# EAGLE design GadgetBox-Papilio-Flex (EAGLE 6.6.0)

## Sheet 1 of 3: Connectors
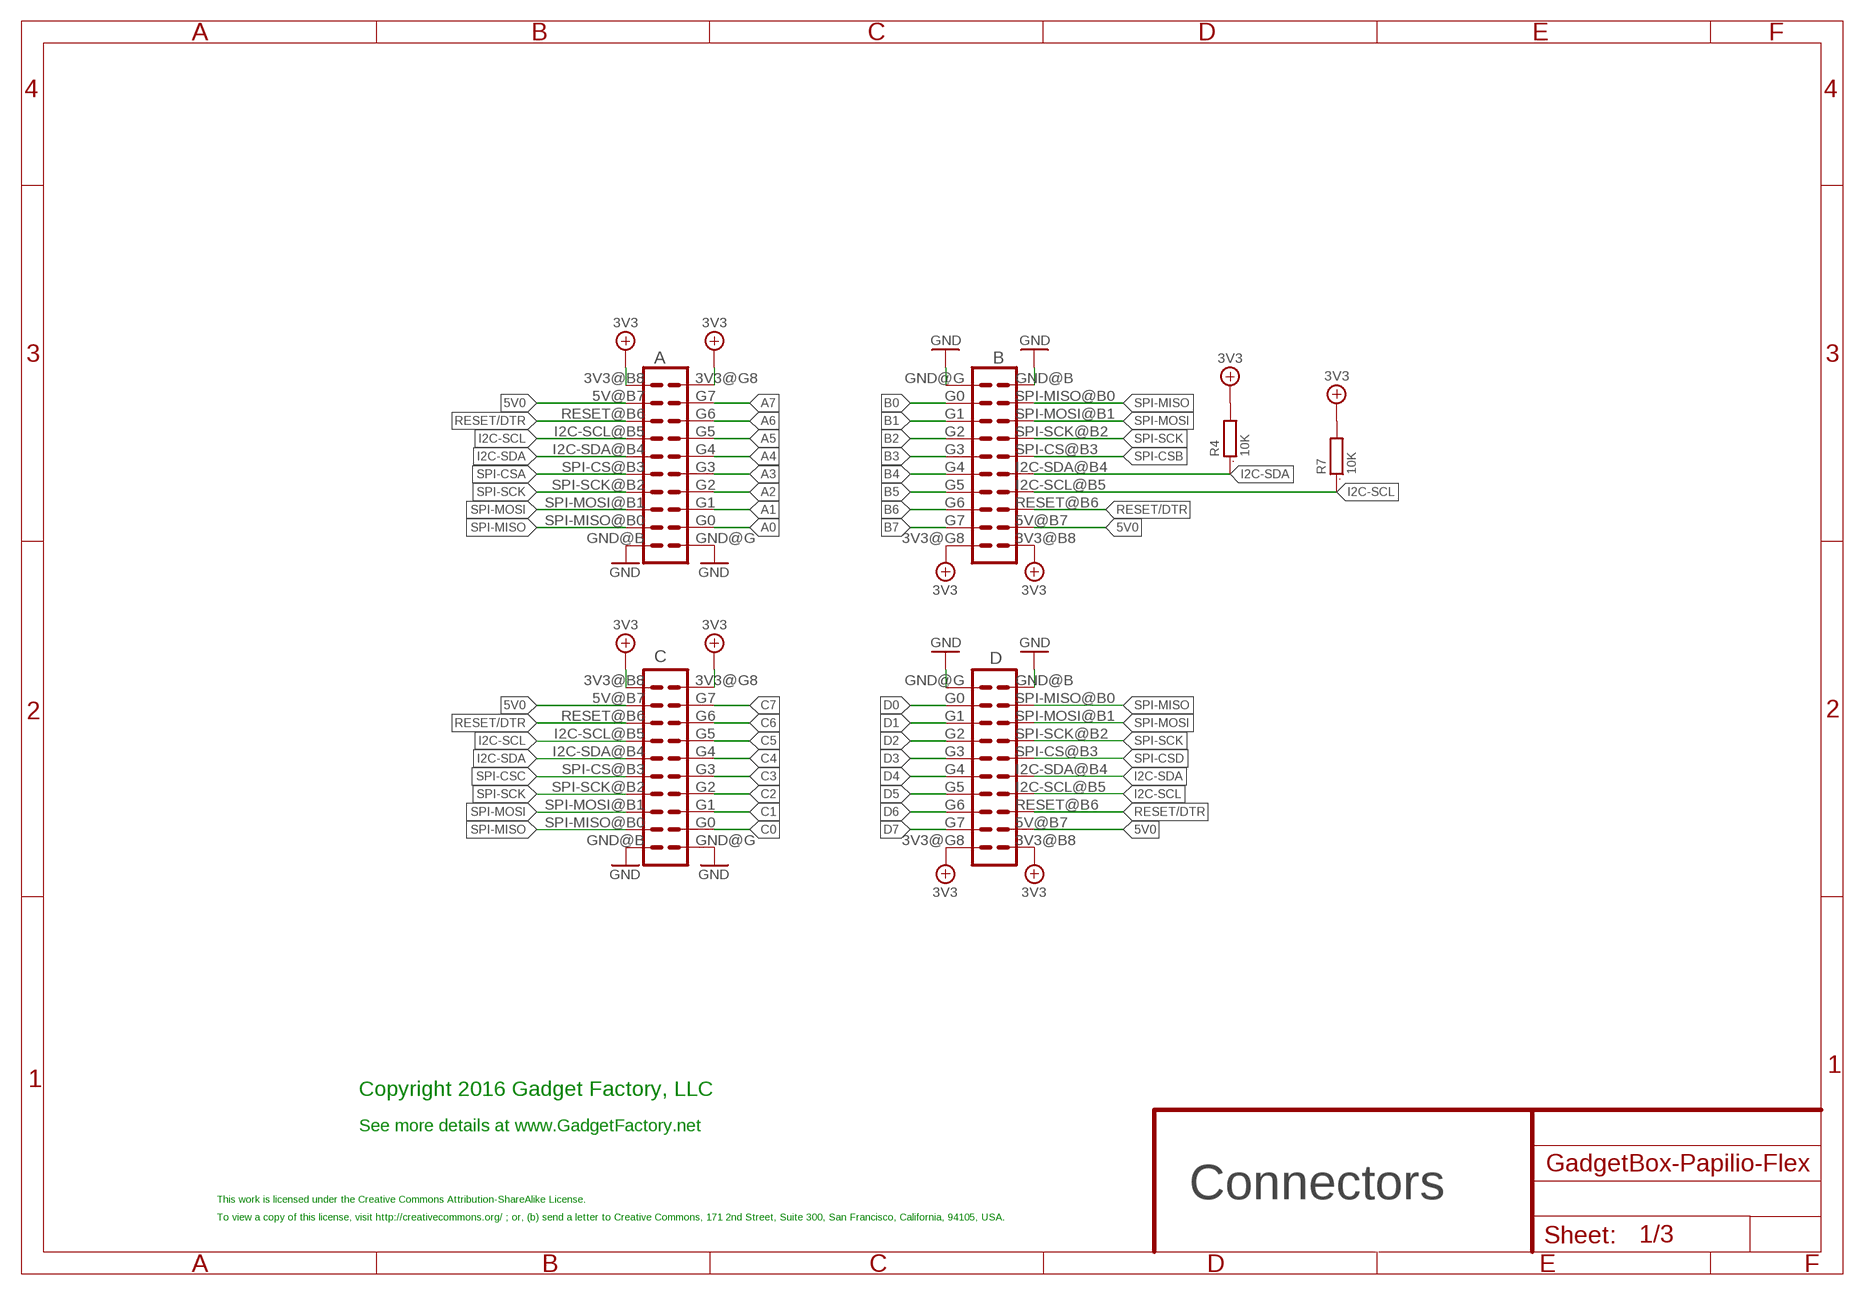
[diagram p0: schematic, sheet 1]

### Parts
A  ECOGECOG_SLOT_ALT1  [ECOG_ALT1]
B  ECOGECOG_SLOT_ALT1  [ECOG_ALT1]
C  ECOGECOG_SLOT_ALT1  [ECOG_ALT1]
D  ECOGECOG_SLOT_ALT1  [ECOG_ALT1]
R4  10K  R0603  [0603]
R7  10K  R0603  [0603]

### Nets
3V3: A.3V3@B8(3V3) A.3V3@G8(3V3) B.3V3@B8(3V3) B.3V3@G8(3V3) C.3V3@B8(3V3) C.3V3@G8(3V3) D.3V3@B8(3V3) D.3V3@G8(3V3) R4.2 R7.2 ; also sheet 2,3
5V0: A.5V@B7(5V) B.5V@B7(5V) C.5V@B7(5V) D.5V@B7(5V) ; also sheet 2,3
A0: A.G0 ; also sheet 3
A1: A.G1 ; also sheet 3
A2: A.G2 ; also sheet 3
A3: A.G3 ; also sheet 3
A4: A.G4 ; also sheet 3
A5: A.G5 ; also sheet 3
A6: A.G6 ; also sheet 3
A7: A.G7 ; also sheet 3
B0: B.G0 ; also sheet 3
B1: B.G1 ; also sheet 3
B2: B.G2 ; also sheet 3
B3: B.G3 ; also sheet 3
B4: B.G4 ; also sheet 3
B5: B.G5 ; also sheet 3
B6: B.G6 ; also sheet 3
B7: B.G7 ; also sheet 3
C0: C.G0 ; also sheet 3
C1: C.G1 ; also sheet 3
C2: C.G2 ; also sheet 3
C3: C.G3 ; also sheet 3
C4: C.G4 ; also sheet 3
C5: C.G5 ; also sheet 3
C6: C.G6 ; also sheet 3
C7: C.G7 ; also sheet 3
D0: D.G0 ; also sheet 3
D1: D.G1 ; also sheet 3
D2: D.G2 ; also sheet 3
D3: D.G3 ; also sheet 3
D4: D.G4 ; also sheet 3
D5: D.G5 ; also sheet 3
D6: D.G6 ; also sheet 3
D7: D.G7 ; also sheet 3
GND: A.GND@B(GND) A.GND@G(GND) B.GND@B(GND) B.GND@G(GND) C.GND@B(GND) C.GND@G(GND) D.GND@B(GND) D.GND@G(GND) ; also sheet 2,3
I2C-SCL: A.I2C-SCL@B5(I2C-SCL) B.I2C-SCL@B5(I2C-SCL) C.I2C-SCL@B5(I2C-SCL) D.I2C-SCL@B5(I2C-SCL) R7.1 ; also sheet 3
I2C-SDA: A.I2C-SDA@B4(I2C-SDA) B.I2C-SDA@B4(I2C-SDA) C.I2C-SDA@B4(I2C-SDA) D.I2C-SDA@B4(I2C-SDA) R4.1 ; also sheet 3
RESET/DTR: A.RESET@B6(RESET) B.RESET@B6(RESET) C.RESET@B6(RESET) D.RESET@B6(RESET) ; also sheet 2,3
SPI-CSA: A.SPI-CS@B3(SPI-CS) ; also sheet 3
SPI-CSB: B.SPI-CS@B3(SPI-CS) ; also sheet 3
SPI-CSC: C.SPI-CS@B3(SPI-CS) ; also sheet 3
SPI-CSD: D.SPI-CS@B3(SPI-CS) ; also sheet 3
SPI-MISO: A.SPI-MISO@B0(SPI-MISO) B.SPI-MISO@B0(SPI-MISO) C.SPI-MISO@B0(SPI-MISO) D.SPI-MISO@B0(SPI-MISO) ; also sheet 3
SPI-MOSI: A.SPI-MOSI@B1(SPI-MOSI) B.SPI-MOSI@B1(SPI-MOSI) C.SPI-MOSI@B1(SPI-MOSI) D.SPI-MOSI@B1(SPI-MOSI) ; also sheet 3
SPI-SCK: A.SPI-SCK@B2(SPI-SCK) B.SPI-SCK@B2(SPI-SCK) C.SPI-SCK@B2(SPI-SCK) D.SPI-SCK@B2(SPI-SCK) ; also sheet 3

### Notes on the sheet
- Copyright 2016 Gadget Factory, LLC
- See more details at www.GadgetFactory.net
- Connectors
- This work is licensed under the Creative Commons Attribution-ShareAlike License.
- To view a copy of this license, visit http://creativecommons.org/ ; or, (b) send a letter to Creative Commons, 171 2nd Street, Suite 300, San Francisco, California, 94105, USA.

## Sheet 2 of 3: Power
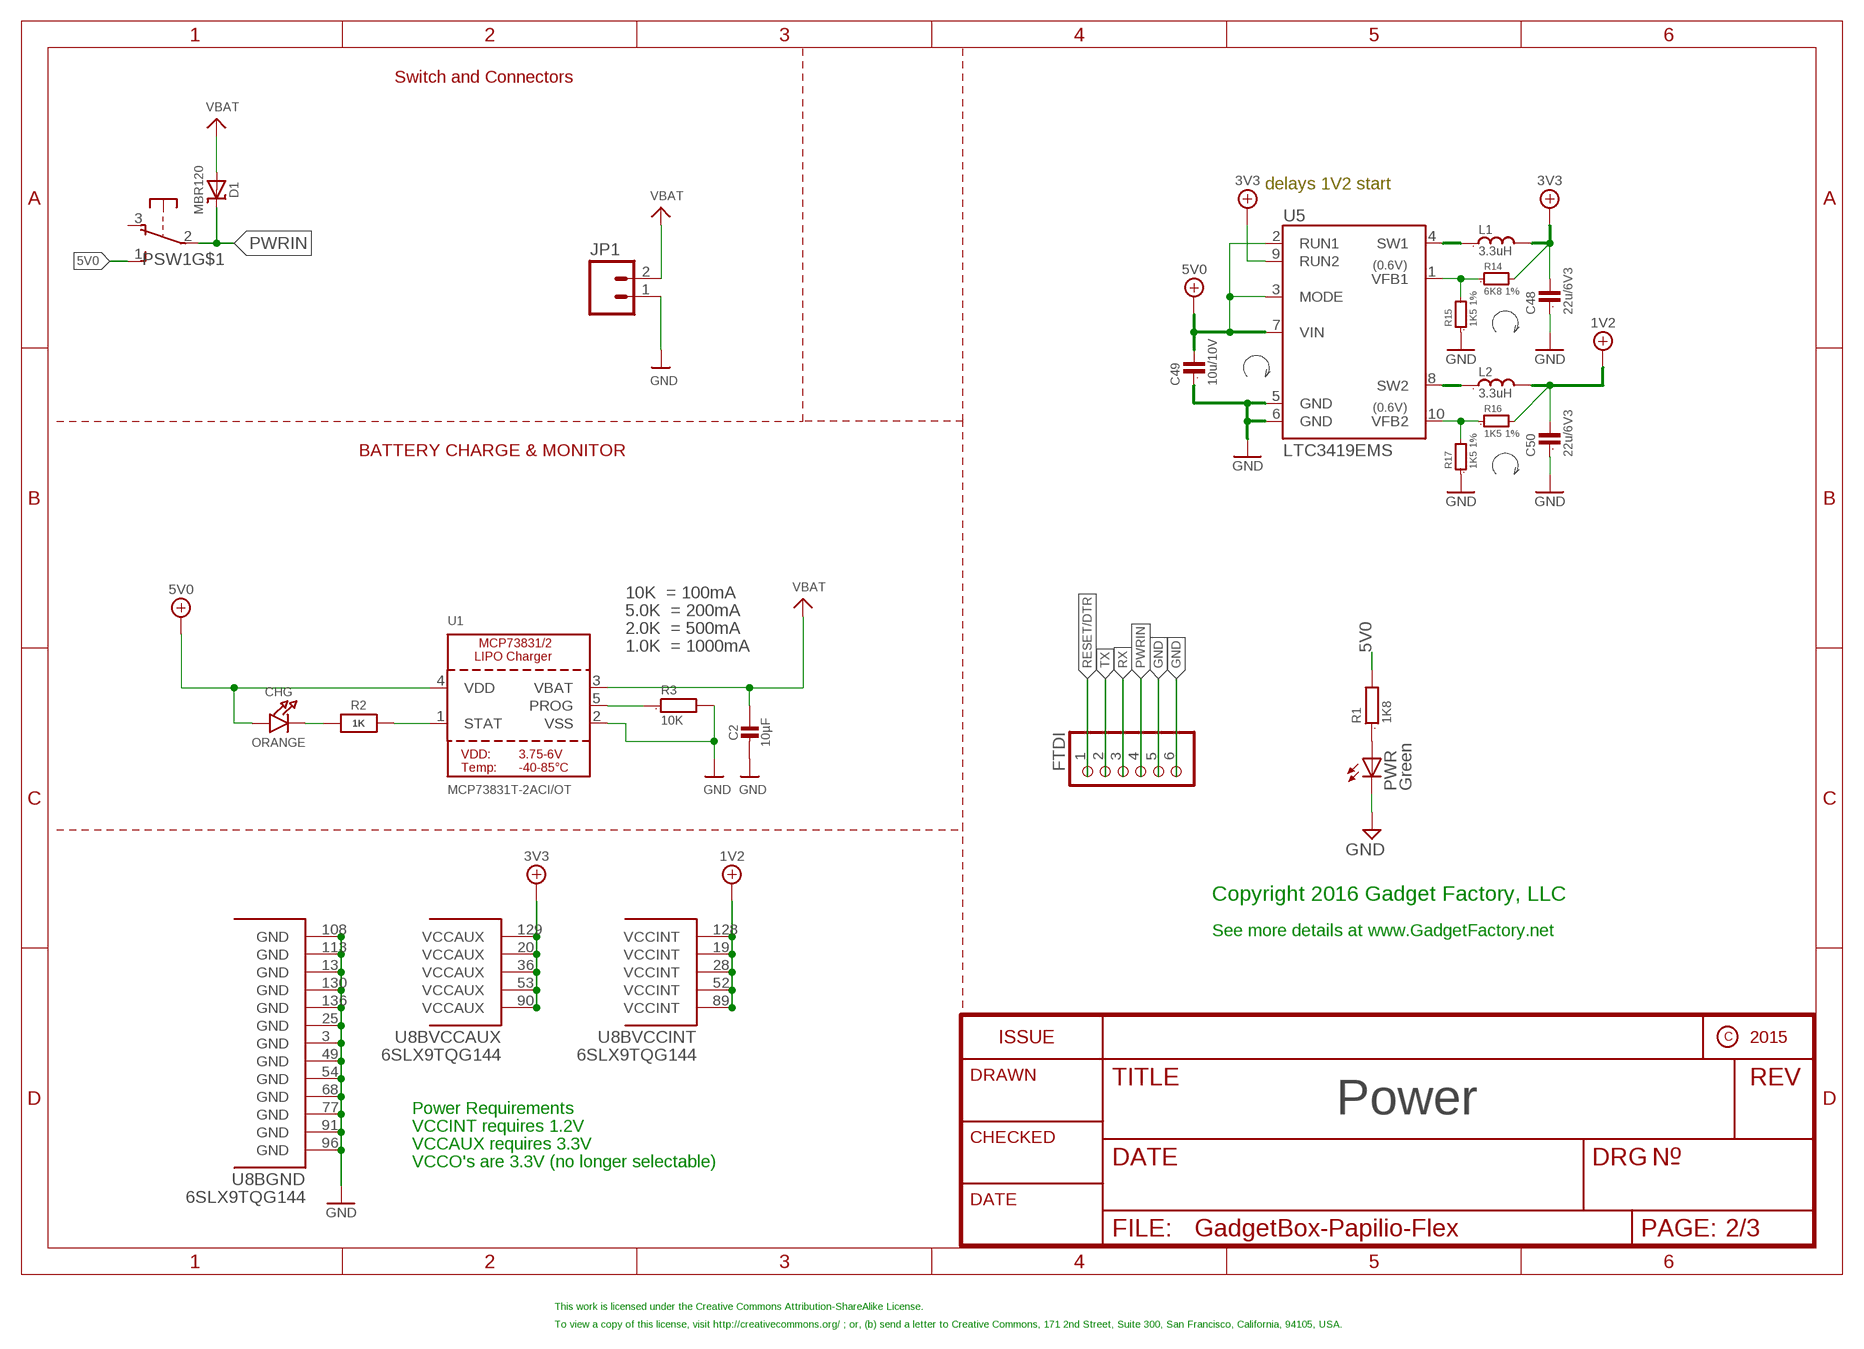
[diagram p1: schematic, sheet 2]

### Parts
C2  10µF  CAP_CERAMIC0805-NOOUTLINE  [0805-NO]
C48  22u/6V3  C0805  [0805]
C49  10u/10V  C0805  [0805]
C50  22u/6V3  C0805  [0805]
CHG  ORANGE  LED0805_NOOUTLINE  [CHIPLED_0805_NOOUTLINE]
D1  MBR120  DIODE-SCHOTTKYSOD-123  [SOD-123]
FTDI  PINHD-1X6  [1X06]
JP1  M02JST-PTH-2  [JST-2-PTH]
L1  3.3uH  L_VLS3015  [VLS3015]
L2  3.3uH  L_VLS3015  [VLS3015]
PSW1  OS102011MA1Q  [OS102011MA1Q]
PWR  Green  LEDCHIP-LED0805  [CHIP-LED0805]
R1  1K8  R0805  [0805]
R2  1K  RESISTOR_0603_NOOUT  [0603-NO]
R3  10K  R0603  [0603]
R14  6K8 1%  R-SMALL0603  [0603]
R15  1K5 1%  R-SMALL0603  [0603]
R16  1K5 1%  R-SMALL0603  [0603]
R17  1K5 1%  R-SMALL0603  [0603]
U1  MCP73831T-2ACI/OT  MCP73831/2  [SOT23-5]
U5  LTC3419EMS  [MSOP10]
U8  6SLX9TQG144  [TQ144]

### Nets
1V2: C50.2 L2.2 R16.2 U8.19(BVCCINT:VCCINT) U8.28(BVCCINT:VCCINT) U8.52(BVCCINT:VCCINT) U8.89(BVCCINT:VCCINT) U8.128(BVCCINT:VCCINT) ; also sheet 3
3V3: C48.2 L1.2 R14.2 U5.9(RUN2) U8.20(BVCCAUX:VCCAUX) U8.36(BVCCAUX:VCCAUX) U8.53(BVCCAUX:VCCAUX) U8.90(BVCCAUX:VCCAUX) U8.129(BVCCAUX:VCCAUX) ; also sheet 1,3
5V0: C49.2 CHG.A PSW1.1(S) R1.2 U1.4(VDD) U5.2(RUN1) U5.3(MODE) U5.7(VIN) ; also sheet 1,3
FB_1V2: R16.1 R17.2 U5.10(VFB2)
FB_3V3: R14.1 R15.2 U5.1(VFB1)
GND: C2.2 C48.1 C49.1 C50.1 FTDI.5 FTDI.6 JP1.1 PWR.C R3.2 R15.1 R17.1 U1.2(VSS) U5.5(GND) U5.6(GND) U8.3(BGND:GND) U8.13(BGND:GND) U8.25(BGND:GND) U8.49(BGND:GND) U8.54(BGND:GND) U8.68(BGND:GND) U8.77(BGND:GND) U8.91(BGND:GND) U8.96(BGND:GND) U8.108(BGND:GND) U8.113(BGND:GND) U8.130(BGND:GND) U8.136(BGND:GND) ; also sheet 1,3
N$1: PWR.A R1.1
N$2: CHG.C R2.1
N$3: R2.2 U1.1(STAT)
N$4: R3.1 U1.5(PROG)
PWRIN: D1.C FTDI.4 PSW1.2(P) ; also sheet 3
RESET/DTR: FTDI.1 ; also sheet 1,3
RX: FTDI.3 ; also sheet 3
SW_1V2: L2.1 U5.8(SW2)
SW_3V3: L1.1 U5.4(SW1)
TX: FTDI.2 ; also sheet 3
VBAT: C2.1 D1.A JP1.2 U1.3(VBAT)
Unconnected: PSW1.3(O) PSW1.MT1(MT) PSW1.MT2(MT)

### Notes on the sheet
- Switch and Connectors
- delays 1V2 start
- BATTERY CHARGE & MONITOR
- 10K  = 100mA
- 5.0K  = 200mA
- 2.0K  = 500mA
- 1.0K  = 1000mA
- Copyright 2016 Gadget Factory, LLC
- See more details at www.GadgetFactory.net
- Power Requirements | Power
- VCCINT requires 1.2V
- VCCAUX requires 3.3V
- VCCO's are 3.3V (no longer selectable)
- This work is licensed under the Creative Commons Attribution-ShareAlike License.
- To view a copy of this license, visit http://creativecommons.org/ ; or, (b) send a letter to Creative Commons, 171 2nd Street, Suite 300, San Francisco, California, 94105, USA.

## Sheet 3 of 3: FPGA
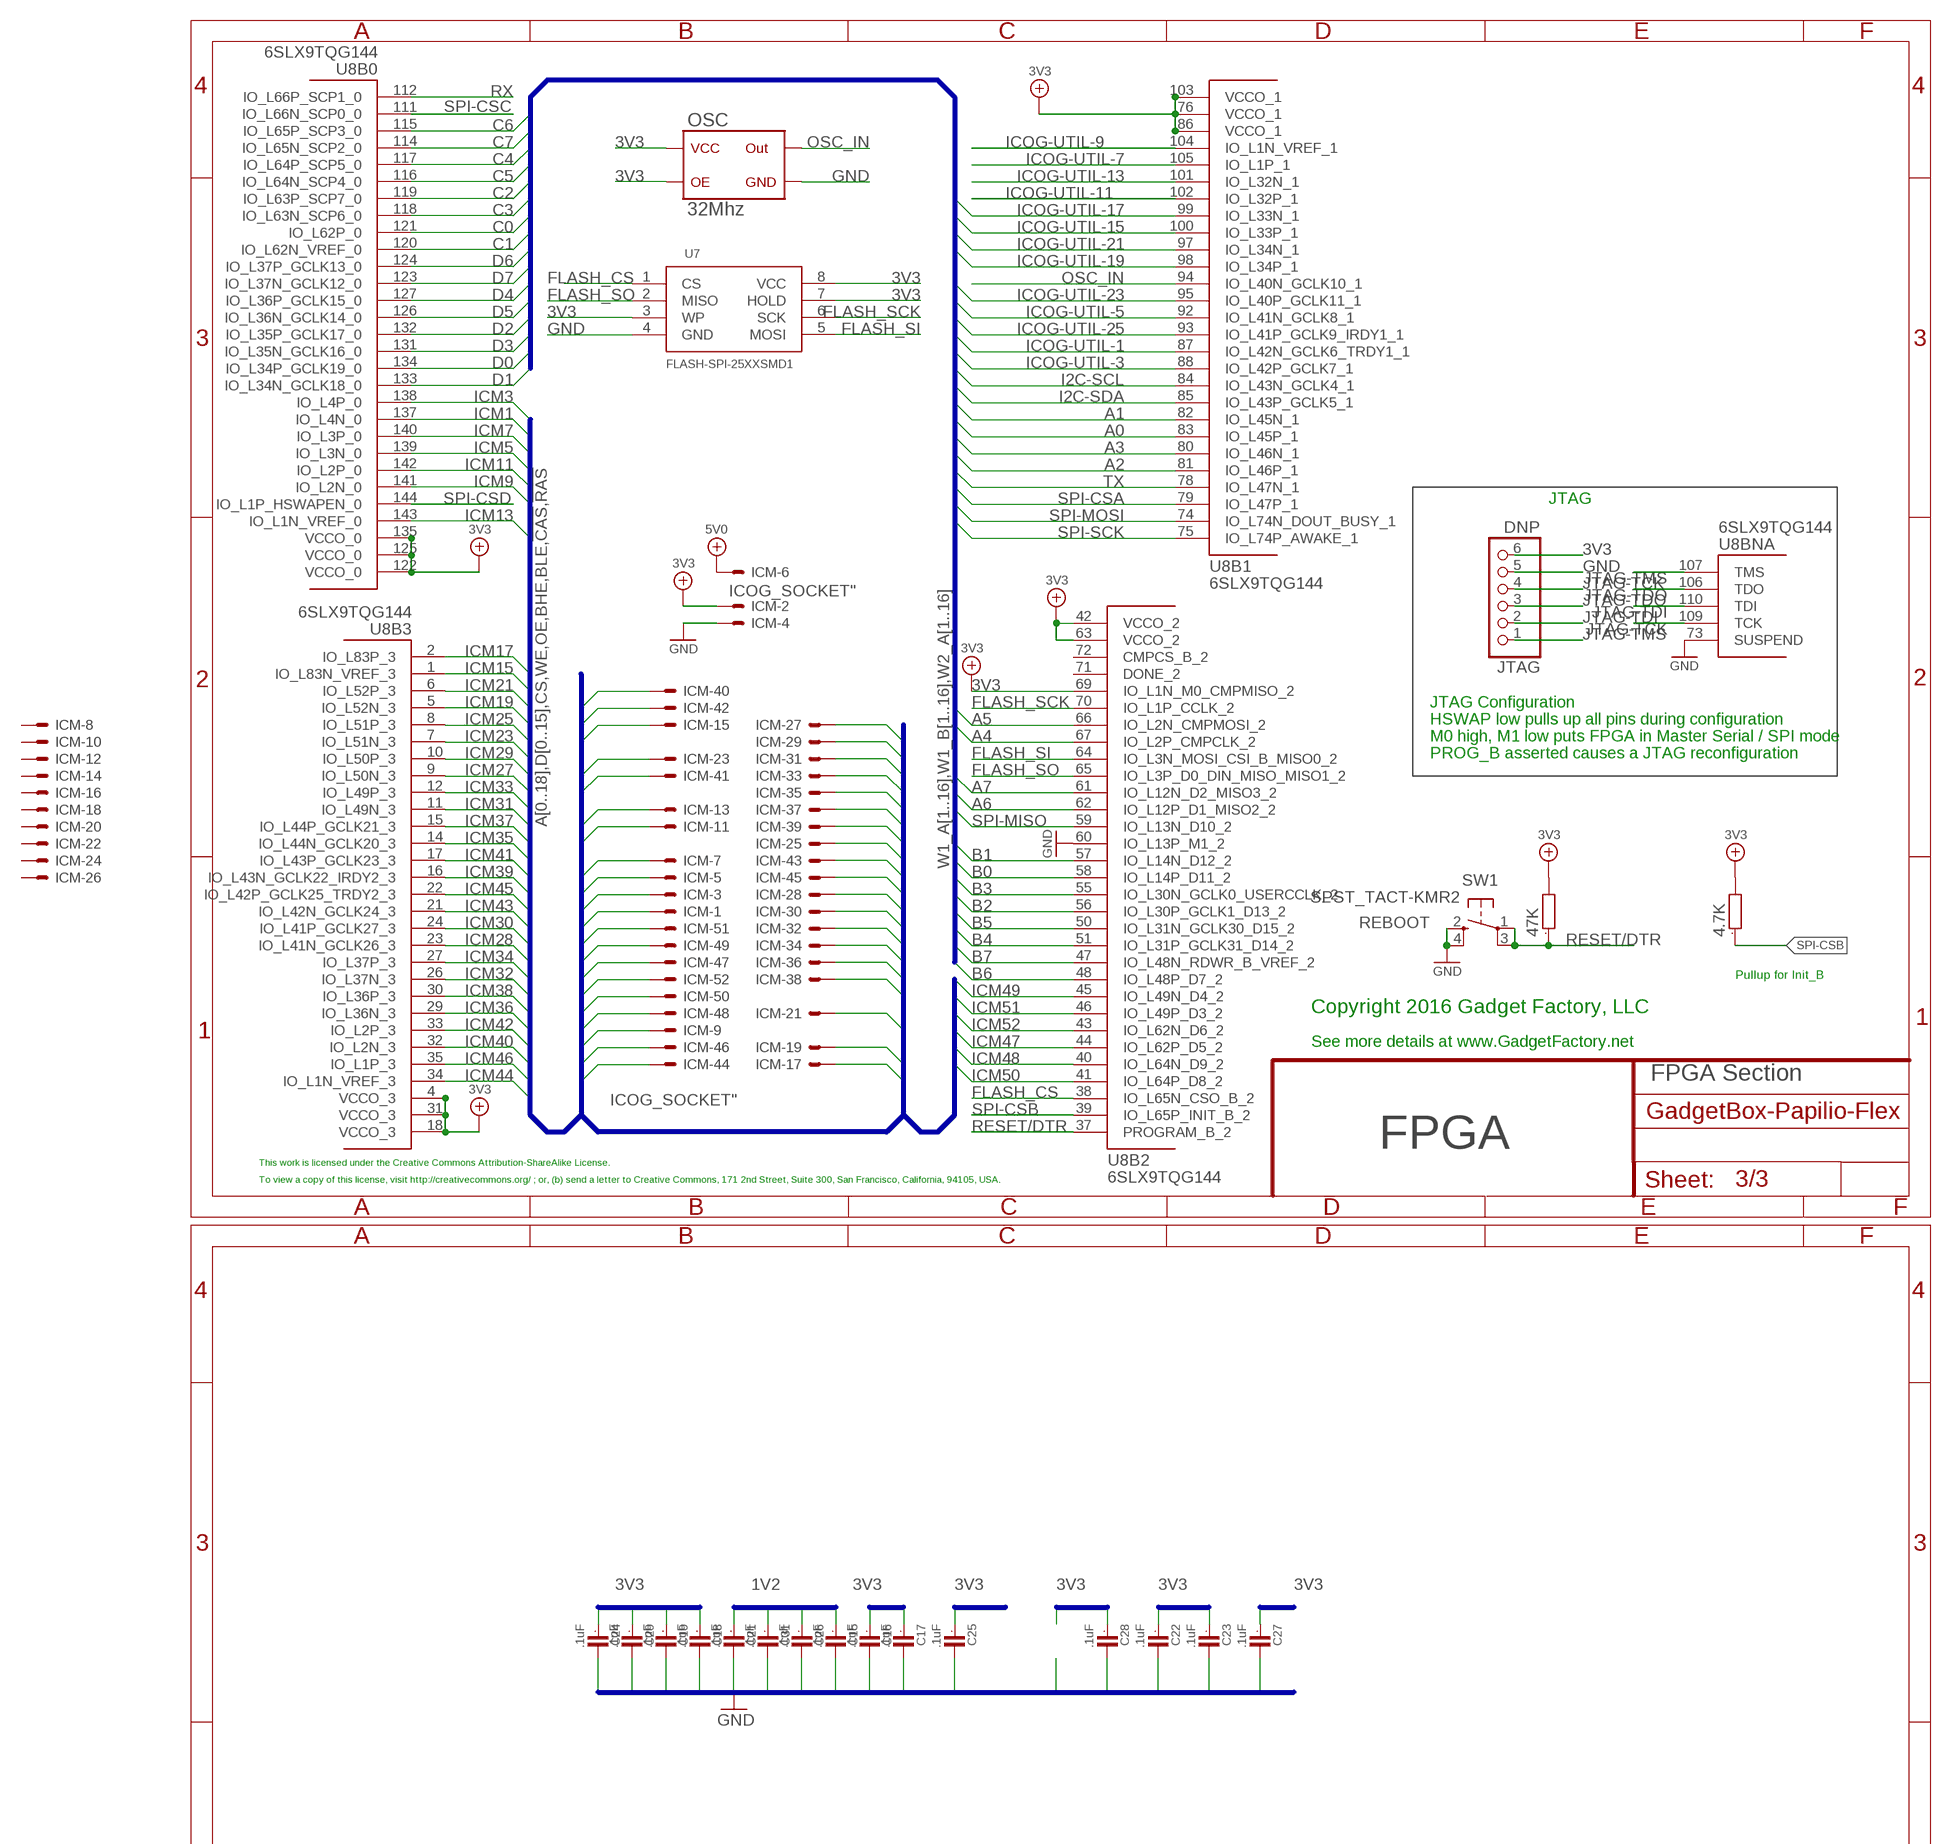
[diagram p2: schematic, sheet 3, part 1 of 2]
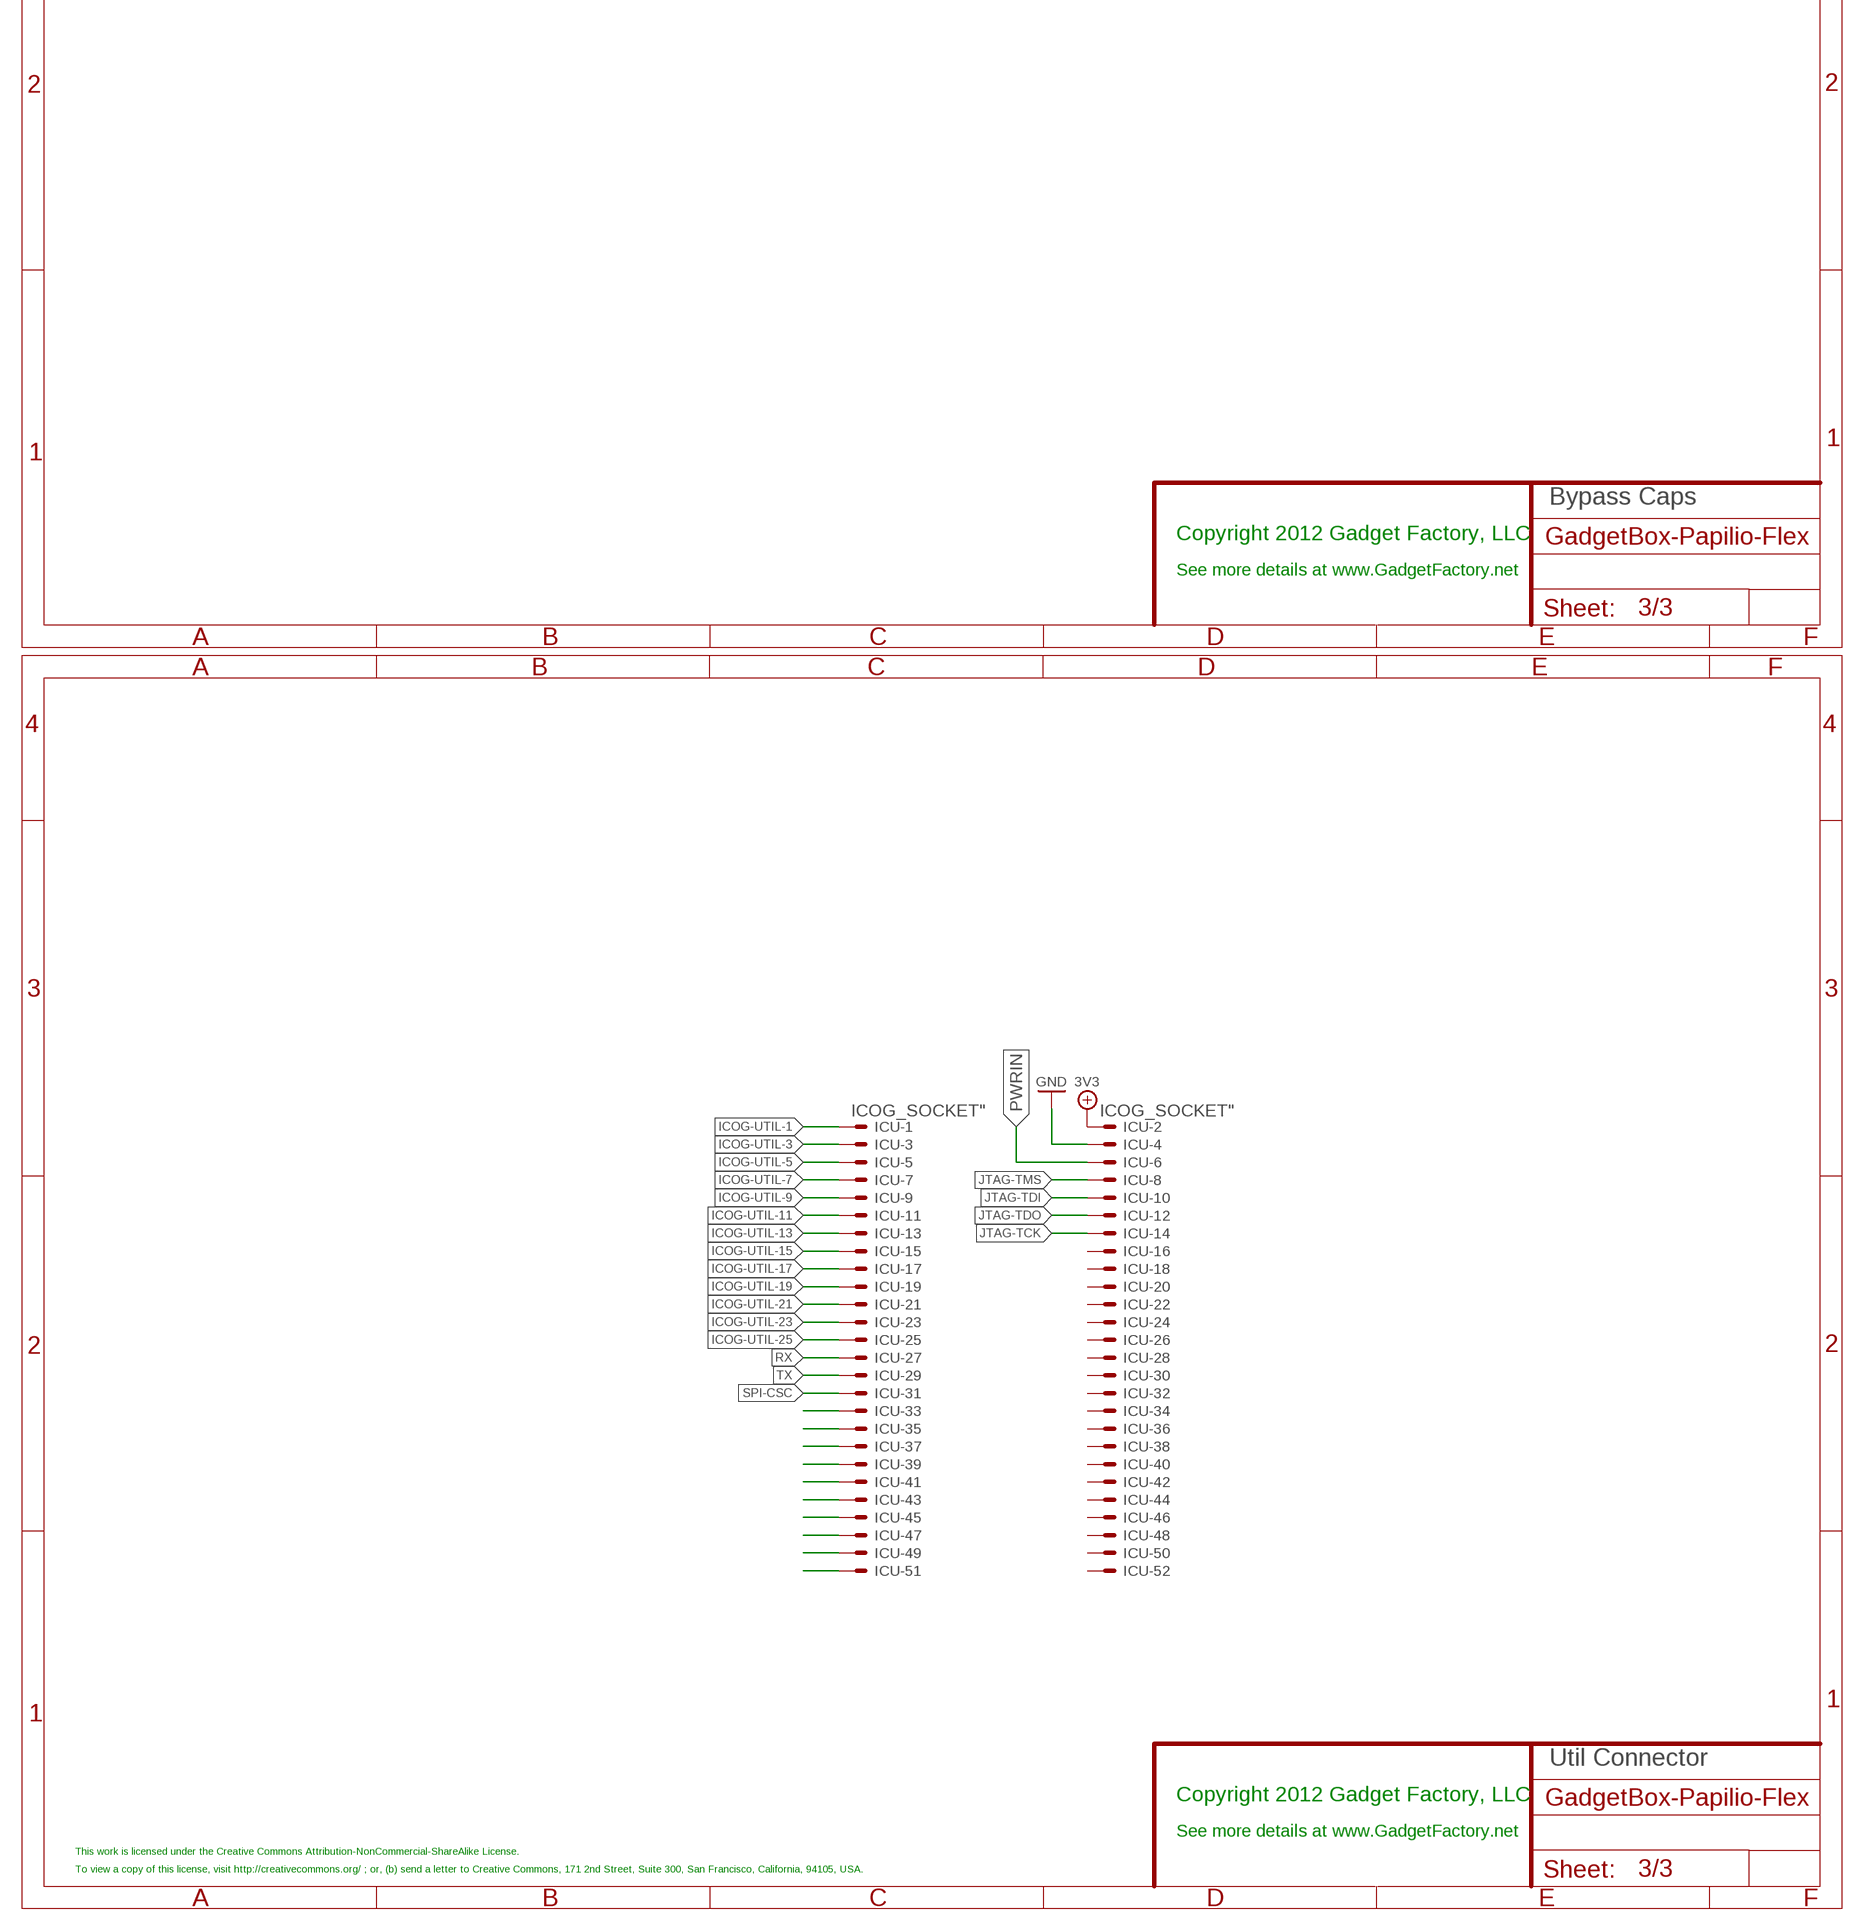
[diagram p3: schematic, sheet 3, part 2 of 2]

### Parts
C15  .1uF  C0603  [0603]
C16  .1uF  C0603  [0603]
C17  .1uF  C0603  [0603]
C18  .1uF  C0603  [0603]
C19  .1uF  C0603  [0603]
C21  .1uF  C0603  [0603]
C22  .1uF  C0603  [0603]
C23  .1uF  C0603  [0603]
C24  .1uF  C0603  [0603]
C25  .1uF  C0603  [0603]
C26  .1uF  C0603  [0603]
C27  .1uF  C0603  [0603]
C28  .1uF  C0603  [0603]
C29  .1uF  C0603  [0603]
C31  .1uF  C0603  [0603]
ICM  ICOG_SOCKET"  [ICOG_STANDARD_STANDOFF]
ICU  ICOG_SOCKET"  [ICOG_STANDARD_STANDOFF]
JTAG  DNP  PINHD-1X6  [1X06]
OSC  32Mhz  OSC1  [OSC1]
R6  4.7K  R0603  [0603]
R33  47K  R0603  [0603]
SW1  SPST_TACT-KMR2  [KMR2]
U7  FLASH-SPI-25XXSMD1  [SO08-EIAJ]

### Nets
1V2: C15.1 C21.1 C26.1 C31.1 ; also sheet 2
3V3: C16.1 C17.1 C18.1 C19.1 C22.1 C23.1 C24.1 C25.1 C27.1 C28.1 C29.1 ICM.2 ICU.2 JTAG.6 OSC.1@1(OE) OSC.4@4(VCC) R6.2 R33.2 U7.3(WP) U7.7(HOLD) U7.8(VCC) U8.4(B3:VCCO_3) U8.18(B3:VCCO_3) U8.31(B3:VCCO_3) U8.42(B2:VCCO_2) U8.63(B2:VCCO_2) U8.69(B2:IO_L1N_M0_CMPMISO_2) U8.76(B1:VCCO_1) U8.86(B1:VCCO_1) U8.103(B1:VCCO_1) U8.122(B0:VCCO_0) U8.125(B0:VCCO_0) U8.135(B0:VCCO_0) ; also sheet 1,2
5V0: ICM.6 ; also sheet 1,2
A0: U8.83(B1:IO_L45P_1) ; also sheet 1
A1: U8.82(B1:IO_L45N_1) ; also sheet 1
A2: U8.81(B1:IO_L46P_1) ; also sheet 1
A3: U8.80(B1:IO_L46N_1) ; also sheet 1
A4: U8.67(B2:IO_L2P_CMPCLK_2) ; also sheet 1
A5: U8.66(B2:IO_L2N_CMPMOSI_2) ; also sheet 1
A6: U8.62(B2:IO_L12P_D1_MISO2_2) ; also sheet 1
A7: U8.61(B2:IO_L12N_D2_MISO3_2) ; also sheet 1
B0: U8.58(B2:IO_L14P_D11_2) ; also sheet 1
B1: U8.57(B2:IO_L14N_D12_2) ; also sheet 1
B2: U8.56(B2:IO_L30P_GCLK1_D13_2) ; also sheet 1
B3: U8.55(B2:IO_L30N_GCLK0_USERCCLK_2) ; also sheet 1
B4: U8.51(B2:IO_L31P_GCLK31_D14_2) ; also sheet 1
B5: U8.50(B2:IO_L31N_GCLK30_D15_2) ; also sheet 1
B6: U8.48(B2:IO_L48P_D7_2) ; also sheet 1
B7: U8.47(B2:IO_L48N_RDWR_B_VREF_2) ; also sheet 1
C0: U8.121(B0:IO_L62P_0) ; also sheet 1
C1: U8.120(B0:IO_L62N_VREF_0) ; also sheet 1
C2: U8.119(B0:IO_L63P_SCP7_0) ; also sheet 1
C3: U8.118(B0:IO_L63N_SCP6_0) ; also sheet 1
C4: U8.117(B0:IO_L64P_SCP5_0) ; also sheet 1
C5: U8.116(B0:IO_L64N_SCP4_0) ; also sheet 1
C6: U8.115(B0:IO_L65P_SCP3_0) ; also sheet 1
C7: U8.114(B0:IO_L65N_SCP2_0) ; also sheet 1
D0: U8.134(B0:IO_L34P_GCLK19_0) ; also sheet 1
D1: U8.133(B0:IO_L34N_GCLK18_0) ; also sheet 1
D2: U8.132(B0:IO_L35P_GCLK17_0) ; also sheet 1
D3: U8.131(B0:IO_L35N_GCLK16_0) ; also sheet 1
D4: U8.127(B0:IO_L36P_GCLK15_0) ; also sheet 1
D5: U8.126(B0:IO_L36N_GCLK14_0) ; also sheet 1
D6: U8.124(B0:IO_L37P_GCLK13_0) ; also sheet 1
D7: U8.123(B0:IO_L37N_GCLK12_0) ; also sheet 1
FLASH_CS: U7.1(CS) U8.38(B2:IO_L65N_CSO_B_2)
FLASH_SCK: U7.6(SCK) U8.70(B2:IO_L1P_CCLK_2)
FLASH_SI: U7.5(MOSI) U8.64(B2:IO_L3N_MOSI_CSI_B_MISO0_2)
FLASH_SO: U7.2(MISO) U8.65(B2:IO_L3P_D0_DIN_MISO_MISO1_2)
GND: C15.2 C16.2 C17.2 C18.2 C19.2 C21.2 C22.2 C23.2 C24.2 C25.2 C26.2 C27.2 C28.2 C29.2 C31.2 ICM.4 ICU.4 JTAG.5 OSC.2@2(GND) SW1.2(S) SW1.4(S1) U7.4(GND) U8.60(B2:IO_L13P_M1_2) U8.73(BNA:SUSPEND) ; also sheet 1,2
I2C-SCL: U8.84(B1:IO_L43N_GCLK4_1) ; also sheet 1
I2C-SDA: U8.85(B1:IO_L43P_GCLK5_1) ; also sheet 1
ICM1: ICM.1 U8.137(B0:IO_L4N_0)
ICM3: ICM.3 U8.138(B0:IO_L4P_0)
ICM5: ICM.5 U8.139(B0:IO_L3N_0)
ICM7: ICM.7 U8.140(B0:IO_L3P_0)
ICM9: ICM.9 U8.141(B0:IO_L2N_0)
ICM11: ICM.11 U8.142(B0:IO_L2P_0)
ICM13: ICM.13 U8.143(B0:IO_L1N_VREF_0)
ICM15: ICM.15 U8.1(B3:IO_L83N_VREF_3)
ICM17: ICM.17 U8.2(B3:IO_L83P_3)
ICM19: ICM.19 U8.5(B3:IO_L52N_3)
ICM21: ICM.21 U8.6(B3:IO_L52P_3)
ICM23: ICM.23 U8.7(B3:IO_L51N_3)
ICM25: ICM.25 U8.8(B3:IO_L51P_3)
ICM27: ICM.27 U8.9(B3:IO_L50N_3)
ICM28: ICM.28 U8.23(B3:IO_L41N_GCLK26_3)
ICM29: ICM.29 U8.10(B3:IO_L50P_3)
ICM30: ICM.30 U8.24(B3:IO_L41P_GCLK27_3)
ICM31: ICM.31 U8.11(B3:IO_L49N_3)
ICM32: ICM.32 U8.26(B3:IO_L37N_3)
ICM33: ICM.33 U8.12(B3:IO_L49P_3)
ICM34: ICM.34 U8.27(B3:IO_L37P_3)
ICM35: ICM.35 U8.14(B3:IO_L44N_GCLK20_3)
ICM36: ICM.36 U8.29(B3:IO_L36N_3)
ICM37: ICM.37 U8.15(B3:IO_L44P_GCLK21_3)
ICM38: ICM.38 U8.30(B3:IO_L36P_3)
ICM39: ICM.39 U8.16(B3:IO_L43N_GCLK22_IRDY2_3)
ICM40: ICM.40 U8.32(B3:IO_L2N_3)
ICM41: ICM.41 U8.17(B3:IO_L43P_GCLK23_3)
ICM42: ICM.42 U8.33(B3:IO_L2P_3)
ICM43: ICM.43 U8.21(B3:IO_L42N_GCLK24_3)
ICM44: ICM.44 U8.34(B3:IO_L1N_VREF_3)
ICM45: ICM.45 U8.22(B3:IO_L42P_GCLK25_TRDY2_3)
ICM46: ICM.46 U8.35(B3:IO_L1P_3)
ICM47: ICM.47 U8.44(B2:IO_L62P_D5_2)
ICM48: ICM.48 U8.40(B2:IO_L64N_D9_2)
ICM49: ICM.49 U8.45(B2:IO_L49N_D4_2)
ICM50: ICM.50 U8.41(B2:IO_L64P_D8_2)
ICM51: ICM.51 U8.46(B2:IO_L49P_D3_2)
ICM52: ICM.52 U8.43(B2:IO_L62N_D6_2)
ICOG-UTIL-1: ICU.1 U8.87(B1:IO_L42N_GCLK6_TRDY1_1)
ICOG-UTIL-3: ICU.3 U8.88(B1:IO_L42P_GCLK7_1)
ICOG-UTIL-5: ICU.5 U8.92(B1:IO_L41N_GCLK8_1)
ICOG-UTIL-7: ICU.7 U8.105(B1:IO_L1P_1)
ICOG-UTIL-9: ICU.9 U8.104(B1:IO_L1N_VREF_1)
ICOG-UTIL-11: ICU.11 U8.102(B1:IO_L32P_1)
ICOG-UTIL-13: ICU.13 U8.101(B1:IO_L32N_1)
ICOG-UTIL-15: ICU.15 U8.100(B1:IO_L33P_1)
ICOG-UTIL-17: ICU.17 U8.99(B1:IO_L33N_1)
ICOG-UTIL-19: ICU.19 U8.98(B1:IO_L34P_1)
ICOG-UTIL-21: ICU.21 U8.97(B1:IO_L34N_1)
ICOG-UTIL-23: ICU.23 U8.95(B1:IO_L40P_GCLK11_1)
ICOG-UTIL-25: ICU.25 U8.93(B1:IO_L41P_GCLK9_IRDY1_1)
JTAG-TCK: ICU.14 JTAG.4 U8.109(BNA:TCK)
JTAG-TDI: ICU.10 JTAG.2 U8.110(BNA:TDI)
JTAG-TDO: ICU.12 JTAG.3 U8.106(BNA:TDO)
JTAG-TMS: ICU.8 JTAG.1 U8.107(BNA:TMS)
N$19: ICU.33
N$20: ICU.35
N$21: ICU.37
N$22: ICU.39
N$23: ICU.41
N$24: ICU.43
N$25: ICU.45
N$26: ICU.47
N$27: ICU.49
N$28: ICU.51
OSC_IN: OSC.3@3(OUT) U8.94(B1:IO_L40N_GCLK10_1)
PWRIN: ICU.6 ; also sheet 2
RESET/DTR: R33.1 SW1.1(P) SW1.3(P1) U8.37(B2:PROGRAM_B_2) ; also sheet 1,2
RX: ICU.27 U8.112(B0:IO_L66P_SCP1_0) ; also sheet 2
SPI-CSA: U8.79(B1:IO_L47P_1) ; also sheet 1
SPI-CSB: R6.1 U8.39(B2:IO_L65P_INIT_B_2) ; also sheet 1
SPI-CSC: ICU.31 U8.111(B0:IO_L66N_SCP0_0) ; also sheet 1
SPI-CSD: U8.144(B0:IO_L1P_HSWAPEN_0) ; also sheet 1
SPI-MISO: U8.59(B2:IO_L13N_D10_2) ; also sheet 1
SPI-MOSI: U8.74(B1:IO_L74N_DOUT_BUSY_1) ; also sheet 1
SPI-SCK: U8.75(B1:IO_L74P_AWAKE_1) ; also sheet 1
TX: ICU.29 U8.78(B1:IO_L47N_1) ; also sheet 2
Unconnected: ICM.8 ICM.10 ICM.12 ICM.14 ICM.16 ICM.18 ICM.20 ICM.22 ICM.24 ICM.26 ICU.16 ICU.18 ICU.20 ICU.22 ICU.24 ICU.26 ICU.28 ICU.30 ICU.32 ICU.34 ICU.36 ICU.38 ICU.40 ICU.42 ICU.44 ICU.46 ICU.48 ICU.50 ICU.52 U8.71(B2:DONE_2) U8.72(B2:CMPCS_B_2)

### Buses
GND
1V2
W1_A[1..16],W1_B[1..16],W2_A[1..16]
3V3
A[0..18],D[0..15],CS,WE,OE,BHE,BLE,!CAS,!RAS

### Notes on the sheet
- JTAG
- JTAG Configuration
- HSWAP low pulls up all pins during configuration
- M0 high, M1 low puts FPGA in Master Serial / SPI mode
- PROG_B asserted causes a JTAG reconfiguration
- REBOOT
- Pullup for Init_B
- Copyright 2016 Gadget Factory, LLC
- See more details at www.GadgetFactory.net
- FPGA Section
- FPGA
- This work is licensed under the Creative Commons Attribution-ShareAlike License.
- To view a copy of this license, visit http://creativecommons.org/ ; or, (b) send a letter to Creative Commons, 171 2nd Street, Suite 300, San Francisco, California, 94105, USA.
- Bypass Caps
- Copyright 2012 Gadget Factory, LLC
- See more details at www.GadgetFactory.net
- Util Connector
- Copyright 2012 Gadget Factory, LLC
- See more details at www.GadgetFactory.net
- This work is licensed under the Creative Commons Attribution-NonCommercial-ShareAlike License.
- To view a copy of this license, visit http://creativecommons.org/ ; or, (b) send a letter to Creative Commons, 171 2nd Street, Suite 300, San Francisco, California, 94105, USA.

## Library data of the parts
A B C D = eCogs:ECOG; PARTNO: PPPC102LFBN-RC,SULLINS CONNECTOR SOLUTIONS,dk,S6106-ND,"CONN HEADER FEM 20POS.1"" DL GOLD", REF67
C2 = microbuilder:CAP_CERAMIC: Ceramic Capacitors For new designs, use the packages preceded by an '_' character since they are more reliable: The following footprints should be used on most boards: _0402 - Standard footprint for regular board layouts _0603 - Standard footprint for regular board layouts _0805 - Standard footprint for regular board layouts _1206 - Standard footprint for regular board layouts For extremely tight-pitch boards where space is at a premium, the following 'micro-pitch' footprints can be used (smaller pads, no silkscreen outline, etc.): _0402MP - Micro-pitch footprint for very dense/compact boards _0603MP - Micro-pitch footprint for very dense/compact boards _0805MP - Micro-pitch footprint for very dense/compact boards _1206MP - Micro-pitch footprint for very dense/compact boards; PARTNO: CL21F106ZPFNNNE,Samsung,DK,1276-3012-1-ND,CAP CER 10UF 10V Y5V 0805, REF1
C15-C19 C21-C29 C31 = GadgetFactory:C: CAPACITOR, European symbol; MPN: 06033D105MAT2A; OC_NEWARK: 50R8324; PARTNO: GRM188F51E104ZA01D,MURATA ELECTRONICS (VA),DK,490-1575-1-ND,CAP CER .1UF 25V Y5V 0603, REF2
C48 C50 = Bogdan_Commons:C: CAPACITOR, European symbol; OC_NEWARK: unknown; PARTNO: GRM21BR60J226ME39L,MURATA ELECTRONICS (VA),DK,490-1719-1-ND,CAP CER 22UF 6.3V 20% X5R 0805, REF28
C49 = Bogdan_Commons:C: CAPACITOR, European symbol; OC_NEWARK: unknown; PARTNO: C2012Y5V1A106Z,TDK CORPORATION (VA),DK,445-1371-1-ND,CAP CER 10UF 10V Y5V 0805, REF1
CHG = microbuilder:LED: LED; PARTNO: LTST-C171EKT,LITE-ON INC (VA),DK,160-1422-1-ND,LED RED ORAN CLEAR THIN 0805 SMD, REF6
D1 = microbuilder:DIODE-SCHOTTKY; PARTNO: MBR120VLSFT3G,on semiconductor,dk,MBR120VLSFT3GOSCT-ND ,DIODE SCHOTTKY 20V 1A SOD123FL , REF71
FTDI = GadgetFactory:PINHD-1X6: PIN HEADER; PARTNO: PPPC061LGBN-RC,SULLINS CONNECTOR SOLUTIONS,dk,S5481-ND ,"6 Position Header Connector 0.100"" (2.54mm) Through Hole - Right Angle Gold ", REF91
ICM ICU = iCogs:ICOG_SOCKET: MINI PCI EXPRESS CONNECTOR 0.8MM PITCH, 52 CIRCUIT Source: http://www.molex.com/pdm_docs/sd/679105700_sd.pdf; PARTNO: 679105700,Molex,DK,WM7125CT-ND ,CONN EDGECARD 52POS R/A GOLD SMD , REF32
JP1 = SparkFun:M02: Header 2 Standard 2-pin 0.1" header. Use with straight break away headers (SKU : PRT-00116), right angle break away headers (PRT-00553), swiss pins (PRT-00743), machine pins (PRT-00117), and female headers (PRT-00115). Molex polarized connector foot print use with SKU : PRT-08233 with associated crimp pins and housings.; PARTNO: B2B-PH-SM4-TB(LF)(SN),JST SALES AMERICA INC (VA),dk,455-1734-1-ND ,"2 Positions Header, Shrouded Connector 0.079 (2.00mm) Through Hole Tin ", REF87
JTAG = GadgetFactory:PINHD-1X6: PIN HEADER; OC_NEWARK: unknown
L1 L2 = Bogdan_Commons:L: INDUCTOR, European symbol; OC_NEWARK: unknown; PARTNO: VLS3015T-3R3M1R2,TDK CORPORATION (VA),DK,445-3696-1-ND,INDUCTOR POWER 3.3UH 1.2A SMD, REF26
OSC = MondoCPLDCore-XC95_Rev1.5:OSC1; MF: Taiyo Yuden (U.S.A.), Inc.; MPN: LB2012T100KR; OC_NEWARK: 18J0844; PARTNO: ASV-32.000MHZ-E-T,Abracon Corporation,DK,535-10082-1-ND,OSC 32.0000 MHZ 3.3V SMT, REF5
PSW1 = adafruit:OS102011MA1Q: OS10201MA1Q through-hole right angle switch http://www.ladyada.net/library/eagle; PARTNO: OS102011MA1QN1,C&K Components,dk,CKN9559-ND,SWITCH SLIDE SPDT 100MA 12V , REF72
PWR = led:LED: LED; OC_NEWARK: unknown; PARTNO: LTST-C170KGKT,LITE-ON INC (VA),DK,160-1414-1-ND,LED GREEN CLEAR 0805 SMD, REF17
R1 = GadgetFactory:R: RESISTOR, European symbol; OC_NEWARK: unknown; PARTNO: MCR10EZPJ182,ROHM SEMICONDUCTOR (PASSIVE) (VA),DK,RHM1.8KARCT-ND,RES 1.8K OHM 1/8W 5% 0805 SMD, REF12
R2 = microbuilder:RESISTOR: Resistors For new designs, use the packages preceded by an '_' character since they are more reliable: The following footprints should be used on most boards: _0402 - Standard footprint for regular board layouts _0603 - Standard footprint for regular board layouts _0805 - Standard footprint for regular board layouts _1206 - Standard footprint for regular board layouts For extremely tight-pitch boards where space is at a premium, the following 'micro-pitch' footprints can be used (smaller pads, no silkscreen outline, etc.): _0402MP - Micro-pitch footprint for very dense/compact boards _0603MP - Micro-pitch footprint for very dense/compact boards _0805MP - Micro-pitch footprint for very dense/compact boards _1206MP - Micro-pitch footprint for very dense/compact boards; PARTNO: RC0603JR-071KL,YAGEO (VA),dk,311-1.0KGRTR-ND,RES SMD 1K OHM 5% 1/10W 0603 , REF73
R3 R4 R7 = GadgetFactory:R: RESISTOR, European symbol; PARTNO: RC0603JR-0710KL,YAGEO (VA),dk,311-10KGRCT-ND,RES SMD 10K OHM 5% 1/10W 0603 , REF36
R6 R33 = GadgetFactory:R: RESISTOR, European symbol; OC_NEWARK: unknown; PARTNO: RC0603JR-0747KL,YAGEO (VA),dk,311-47KGRCT-ND,RES SMD 47K OHM 5% 1/10W 0603 , REF38
R14 = Bogdan_Commons:R-SMALL; OC_NEWARK: unknown; PARTNO: CRCW06036K80FKEA,VISHAY DALE (VA),DK,541-6.80KHCT-ND,RES 6.80K OHM 1/10W 1% 0603 SMD, REF30
R15-R17 = Bogdan_Commons:R-SMALL; OC_NEWARK: unknown; PARTNO: CRCW06031K50FKEA,VISHAY DALE (VA),DK,541-1.50KHCT-ND,RES 1.50K OHM 1/10W 1% 0603 SMD, REF29
SW1 = adafruit:SPST_TACT: SMT 6mm switch, EVQQ2 series http://www.ladyada.net/library/eagle; OC_NEWARK: unknown; PARTNO: KMR231NG LFS,C&K Components,dk,CKN10246CT-ND,SWITCH TACTILE SPST-NO 0.05A 32V , REF40
U1 = microbuilder:MCP73831/2: MCP73831/2 LIPO Charger VDD: 3.75 - 6V Temp -40 - 85°C Programmable Charge Rate: 15-500mA NOTE: STAT is a tri-state logic output on the MCP73831 and an open-drain output on the MCP73832. SOT23-5 with 4.2V output and tri-state logic on STAT = MCP73831T-2ACI/OT; PARTNO: MCP73831T-2ACI/OT,MICROCHIP TECHNOLOGY (VA),dk,MCP73831T-2ACI/OTCT-ND,IC CONTROLLR LI-ION 4.2V SOT23-5, REF74
U5 = Bogdan_Commons:LTC3419: Dual Monolithic 600mA Synchronous Step-Down Regulator; DIGIKEY: LTC3419EMS#PBF-ND; OC_NEWARK: unknown; PARTNO: LTC3419EMS#PBF,LINEAR TECHNOLOGY,DK,LTC3419EMS#PBF-ND,IC REG BUCK SYNC ADJ 0.6A 10MSOP, REF27
U7 = GadgetFactory:FLASH-SPI-25XX: SPI Flash; OC_NEWARK: unknown; PARTNO: MX25L6445EM2I-10G,Macronix,DK,1092-1065-ND,IC FLASH SER 64MB 104MHZ 8SOIC, REF21
U8 = xilinx_devices:6SLX9TQG144: Xilinx FPGA: 6SLX9TQG144; OC_NEWARK: unknown; PARTNO: XC6SLX9-2TQG144C,XILINX INC,DK,122-1745-ND,IC FPGA SPARTAN-6 9K 144TQFP, REF18

## Net classes
0 default: width 0.152 mm, drill 0.381 mm, clearance 0.152 mm
2 gnd: width 0.254 mm, drill 0.381 mm, clearance 0.152 mm
3 usbvcc: width 0.254 mm, drill 0.381 mm, clearance 0.254 mm
4 aref: width 0.254 mm, drill 0.381 mm, clearance 0.254 mm

## Board
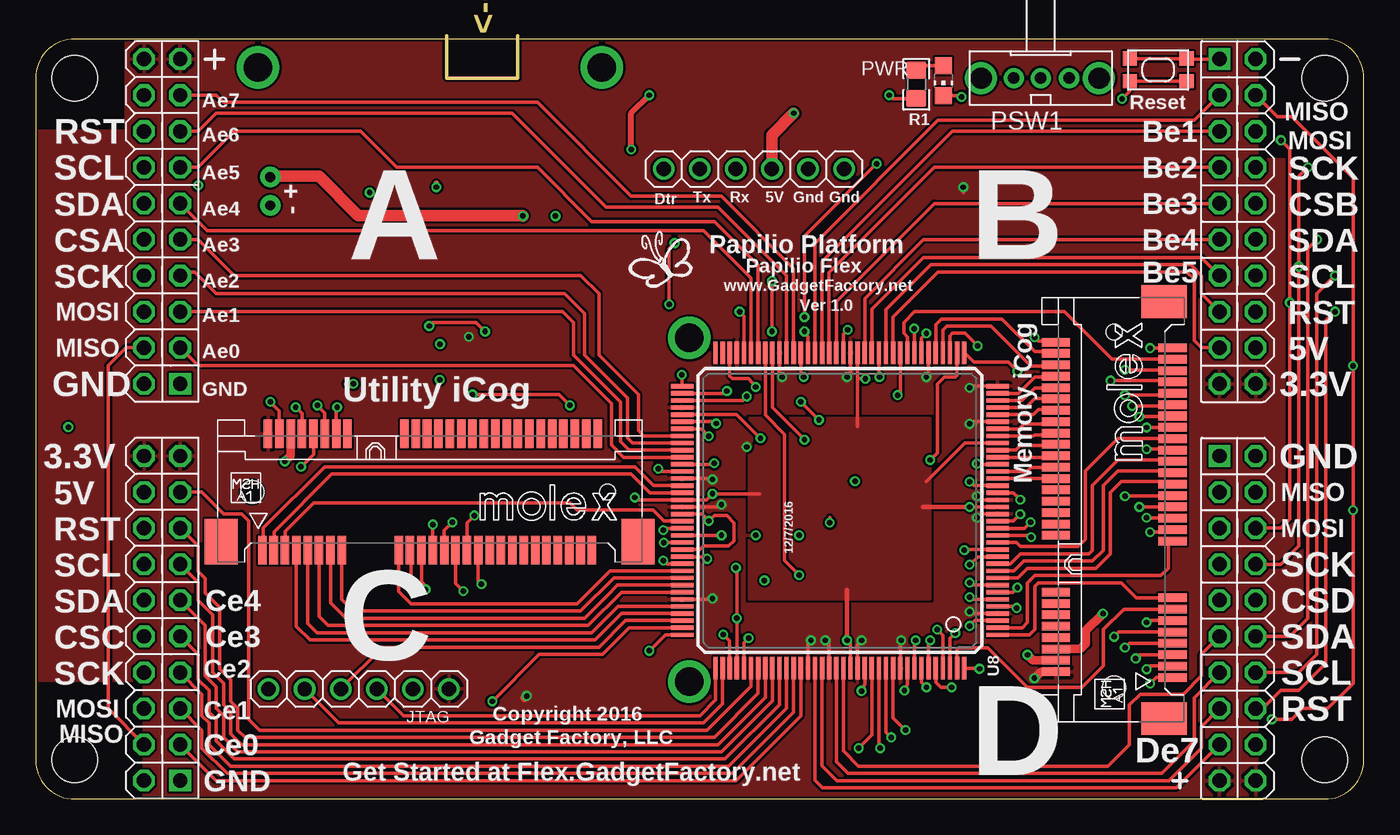
[diagram p4: board, top side]
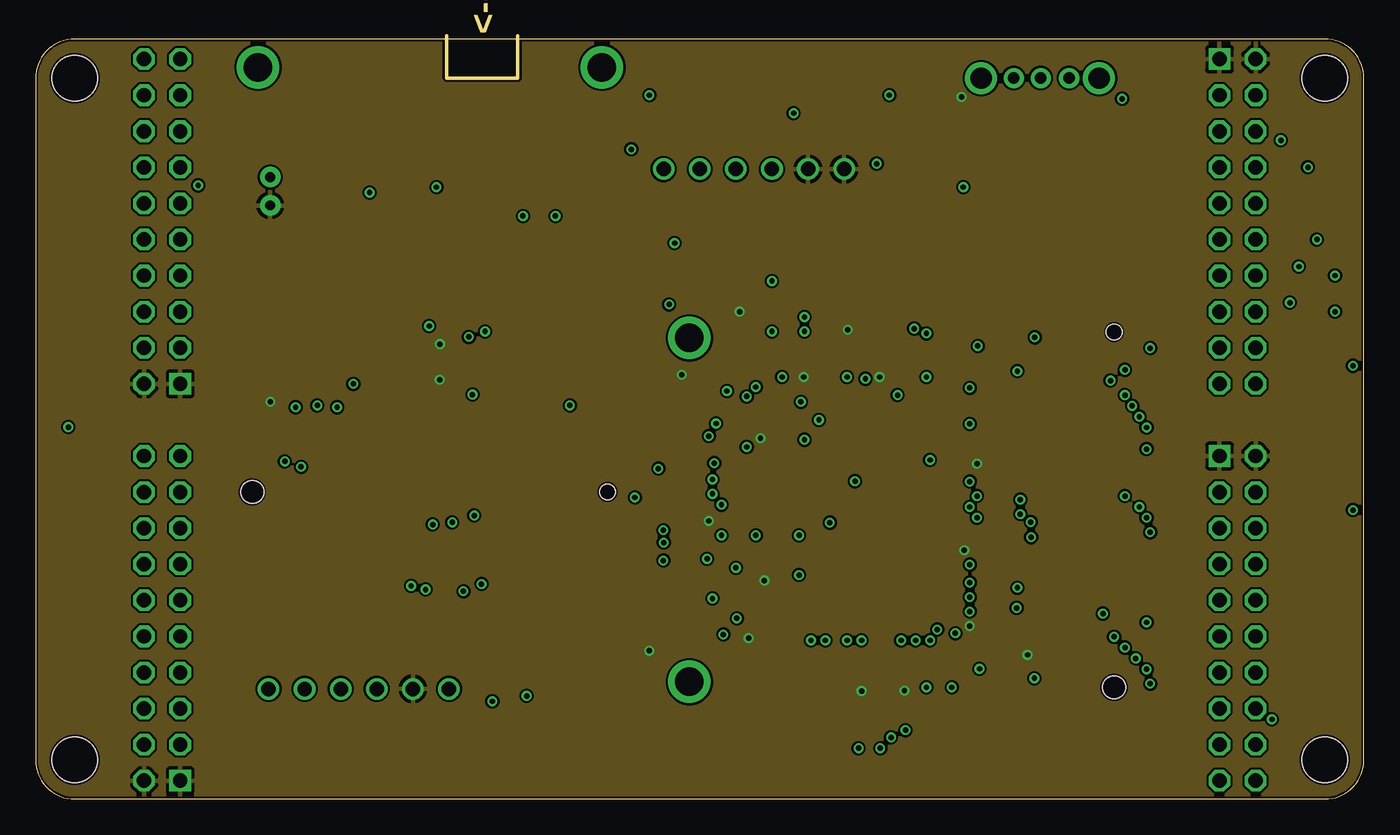
[diagram p5: board, inner layer Route2]
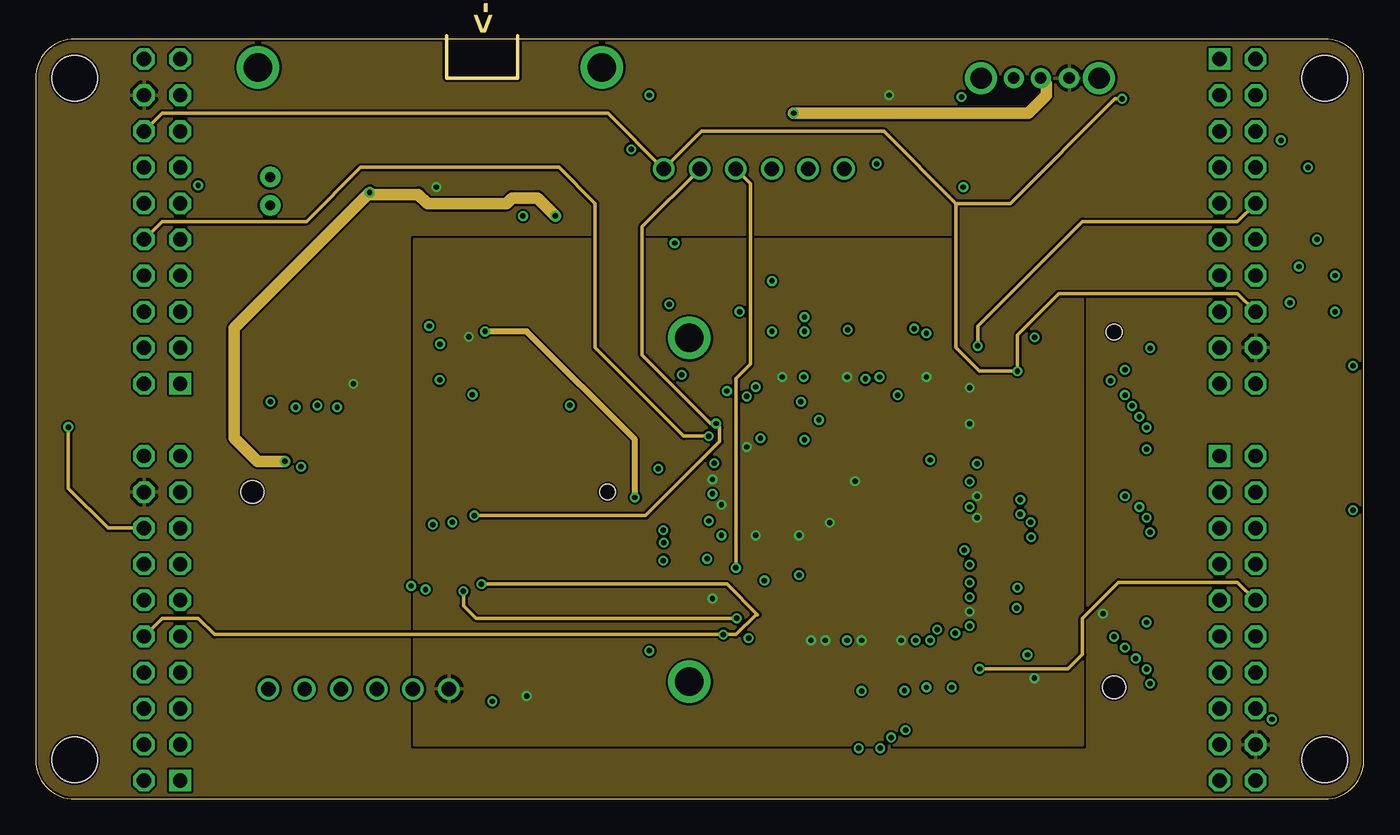
[diagram p6: board, inner layer Route3]
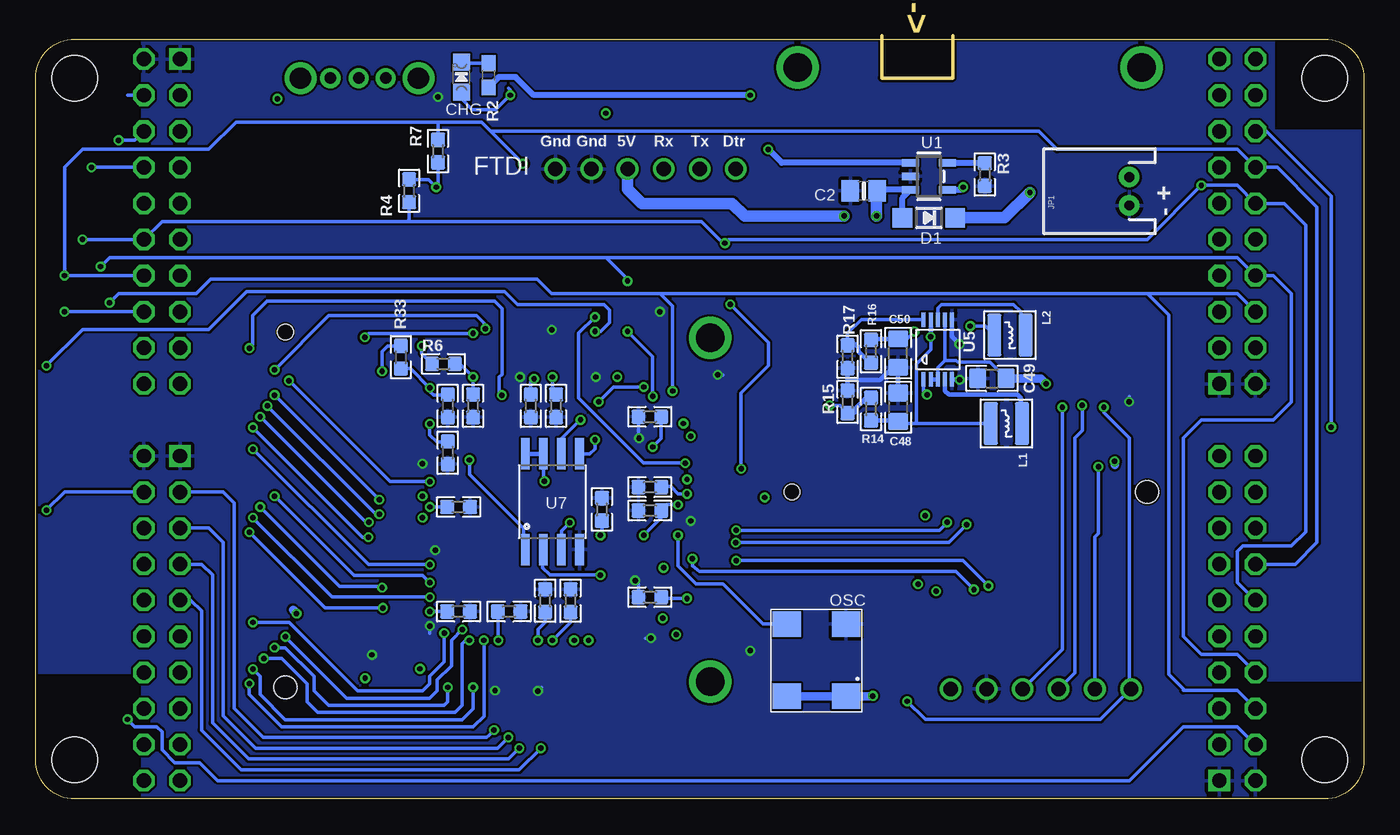
[diagram p7: board, bottom side, seen from below]

Size 93.5 x 53.75 mm. Coordinates in mm from the lower left corner, seen from the top.
Outline: 33.94,53.75 33.94,50.75 28.94,50.75 28.94,53.75
Copper layers (1*2+3*16): Top 0.035mm / dielectric 1.5mm / Route2 0.035mm / dielectric 0.15mm / Route3 0.035mm / dielectric 0.2mm / Bottom 0.035mm
Design rules "hackvana *": minimum track width 6mil, minimum drill 0.3mm, track to track 6mil, track to pad 6mil, pad to pad 6mil, via to via 6mil, smd to smd 0mil, copper to edge 6mil, drill to drill 6mil, minimum pad ring 10mil, minimum via ring 6mil, stop-mask expansion 2mil, vias tented up to drill 100mil, thermal gap 10mil

### Footprints (pad centres in the part's own frame; a part is rotated, then mirrored left to right if it is on the bottom)
ECOG93P53P5 = hole 3.2: 4,4; 92,4; 92,52; 4,52
ECOG_ALT1 = drill 1.016 octagon: 3V3@B8 21.59,3.81; 3V3@G8 21.59,1.27; 5V@B7 19.05,3.81; G0 1.27,1.27; G1 3.81,1.27; G2 6.35,1.27; G3 8.89,1.27; G4 11.43,1.27; G5 13.97,1.27; G6 16.51,1.27; G7 19.05,1.27; GND@B -1.27,3.81; I2C-SCL@B5 13.97,3.81; I2C-SDA@B4 11.43,3.81; RESET@B6 16.51,3.81; SPI-CS@B3 8.89,3.81; SPI-MISO@B0 1.27,3.81; SPI-MOSI@B1 3.81,3.81; SPI-SCK@B2 6.35,3.81 | drill 1.016 square: GND@G -1.27,1.27
0805-NO = smd 1.24 x 1.5: 1 -0.95,0; 2 0.95,0
0603 = smd 1 x 1: 1 -0.8,0; 2 0.8,0
0805 = smd 1.2 x 1.4: 1 -1,0; 2 1,0
CHIPLED_0805_NOOUTLINE = smd 1.2 x 1.2: A 0,-1.05; C 0,1.05
SOD-123 = smd 1.4 x 1.4: A 1.85,0; C -1.85,0
1X06 = drill 1.016: 1 -6.35,0; 2 -3.81,0; 3 -1.27,0; 4 1.27,0; 5 3.81,0; 6 6.35,0
ICOG_STANDARD_STANDOFF = smd 0.6 x 2: 1 0.7,-4.1; 2 1.1,4.1; 3 1.5,-4.1; 4 1.9,4.1; 5 2.3,-4.1; 6 2.7,4.1; 7 3.1,-4.1; 8 3.5,4.1; 9 3.9,-4.1; 10 4.3,4.1; 11 4.7,-4.1; 12 5.1,4.1; 13 5.5,-4.1; 14 5.9,4.1; 15 6.3,-4.1; 16 6.7,4.1; 17 10.3,-4.1; 18 10.7,4.1; 19 11.1,-4.1; 20 11.5,4.1; 21 11.9,-4.1; 22 12.3,4.1; 23 12.7,-4.1; 24 13.1,4.1; 25 13.5,-4.1; 26 13.9,4.1; 27 14.3,-4.1; 28 14.7,4.1; 29 15.1,-4.1; 30 15.5,4.1; 31 15.9,-4.1; 32 16.3,4.1; 33 16.7,-4.1; 34 17.1,4.1; 35 17.5,-4.1; 36 17.9,4.1; 37 18.3,-4.1; 38 18.7,4.1; 39 19.1,-4.1; 40 19.5,4.1; 41 19.9,-4.1; 42 20.3,4.1; 43 20.7,-4.1; 44 21.1,4.1; 45 21.5,-4.1; 46 21.9,4.1; 47 22.3,-4.1; 48 22.7,4.1; 49 23.1,-4.1; 50 23.5,4.1; 51 23.9,-4.1; 52 24.3,4.1 | smd 2.3 x 3.2: M1 27.15,-3.5; M2 -2.2,-3.5 | drill 2 pad 3: MH1 0.4,29.9; MH2 24.6,29.9 | hole 1.6: 0,0 | hole 1.1: 25,0
JST-2-PTH = drill 0.7 pad 1.448: 1 -1,0; 2 1,0
VLS3015 = smd 3 x 1: 1 0,1.1; 2 0,-1.1
OSC1 = smd 1.8 x 2: 1@1 0,0; 2@2 5.08,0; 3@3 5.08,4.2; 4@4 0,4.2
OS102011MA1Q = drill 0.8 pad 1.422: 1 -2,0; 2 0,0; 3 1.9,0 | drill 1.5 pad 2.184: MT1 -4.1,0; MT2 4.2,0
CHIP-LED0805 = smd 1.2 x 1.2: A 0,-1.05; C 0,1.05
0603-NO = smd 1.1 x 1: 1 -0.85,0; 2 0.85,0
KMR2 = smd 1 x 1: 1 2,0.8; 2 2,-0.8; 3 -2,0.8; 4 -2,-0.8
SOT23-5 = smd 0.55 x 1.2: 1 -0.95,-1.3; 2 0,-1.3; 3 0.95,-1.3; 4 0.95,1.3; 5 -0.95,1.3
MSOP10 = smd 0.28 x 1: 1 -1,-2.1; 2 -0.5,-2.1; 3 0,-2.1; 4 0.5,-2.1; 5 1,-2.1; 6 1,2.1; 7 0.5,2.1; 8 0,2.1; 9 -0.5,2.1; 10 -1,2.1
SO08-EIAJ = smd 0.61 x 2.21: 1 -1.905,-3.378; 2 -0.635,-3.378; 3 0.635,-3.378; 4 1.905,-3.378; 5 1.905,3.353; 6 0.635,3.353; 7 -0.635,3.353; 8 -1.905,3.353
TQ144 = smd 1.6 x 0.3: 1 -11.1,8.75; 2 -11.1,8.25; 3 -11.1,7.75; 4 -11.1,7.25; 5 -11.1,6.75; 6 -11.1,6.25; 7 -11.1,5.75; 8 -11.1,5.25; 9 -11.1,4.75; 10 -11.1,4.25; 11 -11.1,3.75; 12 -11.1,3.25; 13 -11.1,2.75; 14 -11.1,2.25; 15 -11.1,1.75; 16 -11.1,1.25; 17 -11.1,0.75; 18 -11.1,0.25; 19 -11.1,-0.25; 20 -11.1,-0.75; 21 -11.1,-1.25; 22 -11.1,-1.75; 23 -11.1,-2.25; 24 -11.1,-2.75; 25 -11.1,-3.25; 26 -11.1,-3.75; 27 -11.1,-4.25; 28 -11.1,-4.75; 29 -11.1,-5.25; 30 -11.1,-5.75; 31 -11.1,-6.25; 32 -11.1,-6.75; 33 -11.1,-7.25; 34 -11.1,-7.75; 35 -11.1,-8.25; 36 -11.1,-8.75; 73 11.1,-8.75; 74 11.1,-8.25; 75 11.1,-7.75; 76 11.1,-7.25; 77 11.1,-6.75; 78 11.1,-6.25; 79 11.1,-5.75; 80 11.1,-5.25; 81 11.1,-4.75; 82 11.1,-4.25; 83 11.1,-3.75; 84 11.1,-3.25; 85 11.1,-2.75; 86 11.1,-2.25; 87 11.1,-1.75; 88 11.1,-1.25; 89 11.1,-0.75; 90 11.1,-0.25; 91 11.1,0.25; 92 11.1,0.75; 93 11.1,1.25; 94 11.1,1.75; 95 11.1,2.25; 96 11.1,2.75; 97 11.1,3.25; 98 11.1,3.75; 99 11.1,4.25; 100 11.1,4.75; 101 11.1,5.25; 102 11.1,5.75; 103 11.1,6.25; 104 11.1,6.75; 105 11.1,7.25; 106 11.1,7.75; 107 11.1,8.25; 108 11.1,8.75 | smd 0.3 x 1.6: 37 -8.75,-11.1; 38 -8.25,-11.1; 39 -7.75,-11.1; 40 -7.25,-11.1; 41 -6.75,-11.1; 42 -6.25,-11.1; 43 -5.75,-11.1; 44 -5.25,-11.1; 45 -4.75,-11.1; 46 -4.25,-11.1; 47 -3.75,-11.1; 48 -3.25,-11.1; 49 -2.75,-11.1; 50 -2.25,-11.1; 51 -1.75,-11.1; 52 -1.25,-11.1; 53 -0.75,-11.1; 54 -0.25,-11.1; 55 0.25,-11.1; 56 0.75,-11.1; 57 1.25,-11.1; 58 1.75,-11.1; 59 2.25,-11.1; 60 2.75,-11.1; 61 3.25,-11.1; 62 3.75,-11.1; 63 4.25,-11.1; 64 4.75,-11.1; 65 5.25,-11.1; 66 5.75,-11.1; 67 6.25,-11.1; 68 6.75,-11.1; 69 7.25,-11.1; 70 7.75,-11.1; 71 8.25,-11.1; 72 8.75,-11.1; 109 8.75,11.1; 110 8.25,11.1; 111 7.75,11.1; 112 7.25,11.1; 113 6.75,11.1; 114 6.25,11.1; 115 5.75,11.1; 116 5.25,11.1; 117 4.75,11.1; 118 4.25,11.1; 119 3.75,11.1; 120 3.25,11.1; 121 2.75,11.1; 122 2.25,11.1; 123 1.75,11.1; 124 1.25,11.1; 125 0.75,11.1; 126 0.25,11.1; 127 -0.25,11.1; 128 -0.75,11.1; 129 -1.25,11.1; 130 -1.75,11.1; 131 -2.25,11.1; 132 -2.75,11.1; 133 -3.25,11.1; 134 -3.75,11.1; 135 -4.25,11.1; 136 -4.75,11.1; 137 -5.25,11.1; 138 -5.75,11.1; 139 -6.25,11.1; 140 -6.75,11.1; 141 -7.25,11.1; 142 -7.75,11.1; 143 -8.25,11.1; 144 -8.75,11.1

### Placement (x,y rotation side)
$$U$1  [ECOG93P53P5]  -1.25,-1.25 0 top
A  11.45,30.5 90 top
B  82.06,50.82 270 top
C  11.45,2.56 90 top
C2  35.2,42.82 180 bottom
C15  50.26,21.96 180 bottom
C16  50.26,26.91 180 bottom
C17  50.26,14.21 180 bottom
C18  64.48,27.68 270 bottom
C19  56.86,27.68 270 bottom
C21  58.64,27.68 270 bottom
C22  60.17,13.2 0 bottom
C23  64.48,24.37 270 bottom
C24  50.26,20.31 180 bottom
C25  62.71,27.68 270 bottom
C26  63.72,20.56 0 bottom
C27  53.64,20.39 90 bottom
C28  63.72,13.2 0 bottom
C29  57.63,13.96 90 bottom
C31  55.85,13.96 90 bottom
C48  32.79,27.58 270 bottom
C49  26.18,29.61 0 bottom
C50  32.79,31.39 90 bottom
CHG  63.52,50.82 0 bottom
D  82.06,22.88 270 top
D1  30.63,40.91 180 bottom
FTDI  50.56,44.35 0 top
ICM  75.91,7.86 90 top
ICU  15.26,21.61 0 top
JP1  16.52,42.79 90 bottom
JTAG  22.75,7.75 0 top
L1  25.17,26.44 270 bottom
L2  24.91,32.66 270 bottom
OSC  36.44,7.23 90 bottom
PSW1  70.75,50.75 180 top
PWR  63.9,50.57 180 top
R1  62,50.31 270 top
R2  61.62,50.95 270 bottom
R3  26.69,43.96 270 bottom
R4  67.2,42.82 90 bottom
R6  64.79,30.63 0 bottom
R7  65.17,45.61 270 bottom
R14  34.69,27.45 270 bottom
R15  36.34,27.96 270 bottom
R16  34.69,31.52 90 bottom
R17  36.34,31.13 90 bottom
R33  67.79,31.1 270 bottom
SW1  79.01,51.33 180 top
U1  30.63,43.84 270 bottom
U5  29.99,31.64 0 bottom
U7  57.12,20.95 0 bottom
U8  56.61,20.31 180 top
U$14  [GADGETFACTORY_LOGO]  41.55,35.45 0 top

### Tracks (layer width: path | path; a pad name or v marks a point on that pad's centre or on a via)
1V2  (via drill 0.38)
  Top 0.254: U8.19 v65.76,20.56 v65.75,20.56 | U8.128 57.36,10.92 v57.12,11.17 | U8.28 65.42,25.06 62.71,22.34 | v31.64,32.91 31.01,33.55 27.96,33.55 v27.71,33.29 | U8.52 57.86,29.59 | 57.86,29.59 57.86,26.24 57.86,26.23 | v58.41,29.59 57.86,29.59 | v42.18,21.23 42.35,21.06 U8.89 47.22,21.06 v47.65,21.48 50.95,21.48
  Top 0.305: v57.12,11.17 57.12,14.72 | v65.75,20.56 62.45,20.56
  Route3 0.406: v42.18,21.23 42.18,25.29 34.56,32.91 v31.64,32.91
  Bottom 0.254: v65.75,20.56 C26.1 | v57.12,11.17 55.85,12.44 C31.1 | C50.2 32.17,32.39 v31.64,32.91 | L2.2 26.65,33.29 v27.71,33.29 | 49.31,21.96 C15.1 49.43,21.99 48.79,21.99 48.28,21.48 v47.65,21.48 | C21.1 58.64,29.36 v58.41,29.59
  Bottom 0.305: C50.2 34.62,32.39 R16.2
  pour Top: 50.26,14.09 50.26,26.79 62.96,26.79 62.96,14.09
3V3  (via drill 0.38)
  Top 0.254: U8.63 52.36,29.89 v52.55,29.71 | U8.53 57.36,29.95 v57.12,29.71 | U8.42 62.86,29.86 v62.71,29.71 | U8.36 65.87,29.06 v65.75,28.95 | U8.31 65.91,26.56 v65.75,26.41 | U8.4 65.89,13.06 v65.75,13.2 | U8.135 60.86,11.1 v60.93,11.17 | U8.129 57.86,10.89 v58.13,11.17 | U8.20 66.53,21.06 v66.26,21.33 | U8.18 66.52,20.06 v66.26,19.8 | U8.122 54.36,10.95 v54.58,11.17 | U8.125 55.86,10.9 v55.59,11.17 | U8.103 47.59,14.06 v47.65,14.12 | v53.74,18.56 53.74,18.43 | v55.9,19.45 55.9,19.83 | v50.69,18.56 50.95,18.56 | v50.06,24.79 49.8,24.79 | v57.68,22.37 57.42,22.37 | U8.86 47.58,22.56 v47.65,22.5 | U8.90 48.12,20.56 v48.28,20.72 | v65.3,43.07 65.3,42.69
  Top 0.61: ICM.2 70.76,8.96 v70.3,8.5 | v34.56,7.26 34.44,7.13
  Bottom 0.254: v57.12,29.71 57.12,28.73 C19.1 | C25.1 v62.71,29.71 63.62,30.63 R6.2 | C18.1 64.52,28.44 65.5,28.44 65.75,28.69 v65.75,28.95 67.11,30.3 R33.2 | v65.75,26.41 65.75,25.64 65.25,25.14 64.52,25.14 C23.1 | v65.75,13.2 C28.1 | v60.93,11.17 60.93,13.16 C22.1 | v58.13,11.17 58.13,11.93 57.63,12.44 C29.1 | v66.26,21.33 66.01,21.33 | v66.26,19.8 66.01,19.8 | v54.58,11.17 54.32,11.17 | v55.59,11.17 55.85,11.17 | L1.2 31.52,26.44 | 31.52,26.44 32.64,26.44 C48.2 | v30.49,32.54 30.49,31.65 31.52,30.63 31.52,26.44 | v47.65,14.12 49.36,14.12 C17.1 | C27.1 53.64,18.66 v53.74,18.56 | U7.3 56.48,18.87 v55.9,19.45 | v50.69,18.56 49.46,19.8 C24.1 49.05,20.72 v48.28,20.72 | C16.1 49.46,25.38 v50.06,24.79 | U7.7 57.75,22.45 v57.68,22.37 | v47.65,22.5 47.9,22.5 | R7.2 65.17,43.2 v65.3,43.07 65.84,43.62 R4.2
  Bottom 0.305: U5.9 v30.49,32.54 v30.5,32.53 | U7.7 U7.8 | R14.2 32.86,26.65 C48.2
  Bottom 0.61: OSC.4@4 OSC.1@1 34.59,7.23 v34.56,7.26
  pour Top (rank 2): -1.25,8.37 -1.25,47.03 6.37,47.03 6.37,54.63 85.95,54.63 85.95,45.01 94.92,45.01 94.92,8.37 85.95,8.37 85.95,-1.25 7.64,-1.25 7.64,8.37
  pour Route3: 26.69,39.39 73.68,39.39 73.68,3.83 26.69,3.83
5V0  (via drill 0.38)
  Top 0.254: R1.2 60.33,49.31 v60.09,49.55
  Top 0.406: v28.21,43.07 28.21,43.33
  Top 0.61: v22.37,29.23 21.99,29.23 | ICM.6 73.56,10.56 73.93,10.94 73.93,11.86 v75.13,13.05
  Bottom 0.254: U5.7 29.49,30.87 | 29.49,30.87 29.99,30.37 U5.3 | 29.49,30.87 28.71,30.87 28.59,30.75 26.32,30.75 C49.2 | 60.22,50.06 60.09,49.93 v60.09,49.55 61.11,48.53 62.76,48.53 63.52,49.3 CHG.A
  Bottom 0.305: U5.2 U5.3
  Bottom 0.406: U1.4 28.4,42.88 v28.21,43.07
  Bottom 0.61: C49.2 22.75,29.61 v22.37,29.23 | v75.13,13.05 75.13,13.08 75.38,13.33
  pour Route3 (rank 2): -3.79,57.17 96.54,57.17 96.54,-3.79 -3.79,-3.79
A0
  Top 0.254: 10.43,31.52 A.G0 11.45,30.5 37.87,30.5 40.53,27.83 40.53,24.91 41.38,24.06 U8.83
A1
  Top 0.254: U8.82 41.77,24.56 41.17,25.17 41.17,27.96 37.87,31.26 37.87,33.55 37.1,34.31 A.G1
A2
  Top 0.254: A.G2 10.43,37.1 11.2,37.1 12.72,35.58 37.23,35.58 38.63,34.18 38.63,31.26 41.68,28.21 41.68,25.42 42.04,25.06 U8.81
A3
  Top 0.254: U8.80 42.81,25.56 42.44,25.93 42.44,28.47 39.64,31.26 39.64,35.58 38.37,36.85 13.99,36.85 11.45,39.39 A.G3
A4
  Top 0.254: U8.67 50.36,36.67 47.01,40.02 29.61,40.02 27.58,40.02 12.09,40.02 A.G4
A5
  Top 0.254: U8.66 50.86,37.57 47.77,40.66 39.14,40.66 35.33,44.47 25.42,44.47 22.88,47.01 13.99,47.01 11.45,44.47 A.G5
A6
  Top 0.254: U8.62 52.86,36.84 48.03,41.68 40.15,41.68 35.2,46.63 34.82,47.01 33.55,48.28 12.72,48.28 11.45,47.01 A.G6
A7
  Top 0.254: U8.61 53.36,37.36 48.28,42.44 41.93,42.44 35.33,49.04 13.23,49.04 12.72,49.55 A.G7
B0
  Top 0.254: U8.58 54.86,39.11 63.52,47.77 81.55,47.77 B.G0
B1
  Top 0.254: U8.57 55.36,37.83 64.54,47.01 B.G1
B2
  Top 0.254: U8.56 55.86,37.06 63.27,44.47 B.G2
B3
  Top 0.254: U8.55 56.36,35.02 63.27,41.93 B.G3
B4
  Top 0.254: B.G4 62.5,39.39 58.36,35.25 U8.51
B5
  Top 0.254: B.G5 82.06,38.12 62.5,38.12 58.86,34.48 U8.50
B6
  Top 0.254: B.G6 82.06,35.58 82.06,36.85 81.3,37.61 63.01,37.61 59.86,34.46 U8.48
B7
  Top 0.254: B.G7 82.06,31.77 81.55,32.28 81.55,36.6 81.05,37.1 63.52,37.1 60.36,33.94 U8.47
C0
  Top 0.254: U8.121 53.86,5.85 49.3,1.29 12.72,1.29 C.G0
C1
  Top 0.254: U8.120 53.36,6.12 49.04,1.8 13.48,1.8 11.7,3.58 11.7,4.85 C.G1
C2
  Top 0.254: U8.119 52.86,6.38 48.79,2.31 13.74,2.31 12.21,3.83 12.21,5.35 11.7,5.86 11.7,7.39 C.G2
C3
  Top 0.254: U8.118 52.36,6.64 48.53,2.81 13.99,2.81 12.72,4.08 12.72,5.61 12.21,6.12 12.21,7.64 11.45,8.4 11.45,10.18 C.G3
C4
  Top 0.254: U8.117 51.86,6.9 48.28,3.32 14.24,3.32 13.23,4.34 13.23,5.86 12.72,6.37 12.72,7.89 11.96,8.66 11.96,12.21 C.G4
C5
  Top 0.254: U8.116 51.36,7.16 48.03,3.83 14.5,3.83 13.74,4.59 13.74,6.12 13.23,6.62 13.23,8.15 12.47,8.91 12.47,12.97 11.45,13.99 11.45,15.26 C.G5
C6
  Top 0.254: U8.115 50.86,7.43 47.77,4.34 14.75,4.34 14.24,4.85 14.24,6.37 13.74,6.88 13.74,8.4 12.97,9.16 12.97,13.48 11.96,14.5 11.96,15.51 11.45,16.02 11.45,17.8 C.G6
C7
  Top 0.254: C.G7 11.7,21.61 13.23,20.09 14.5,20.09 15.01,19.58 15.01,5.61 15.77,4.85 45.74,4.85 46.25,4.85 47.26,4.85 50.36,7.94 U8.114
D0  (via drill 0.38)
  Top 0.254: U8.134 60.36,5.72 v61.23,4.85
  Bottom 0.254: D.G0 80.28,21.61 79.52,20.85 79.52,6.37 77.49,4.34 61.74,4.34 61.62,4.46 v61.23,4.85
D1  (via drill 0.38)
  Top 0.254: 59.96,4.59 v60.22,4.34 59.86,4.7 U8.133
  Bottom 0.254: D.G1 81.3,19.07 80.28,18.05 80.28,5.86 78,3.58 60.98,3.58 v60.22,4.34
D2  (via drill 0.38)
  Top 0.254: U8.132 59.36,3.67 v59.46,3.58
  Bottom 0.254: D.G2 81.81,16.53 81.05,15.77 81.05,5.35 78.51,2.81 60.22,2.81 v59.46,3.58
D3  (via drill 0.38)
  Top 0.254: U8.131 58.86,4.5 v57.93,3.58
  Bottom 0.254: D.G3 82.57,13.99 81.81,13.23 81.81,4.85 79.01,2.05 59.46,2.05 v57.93,3.58
D4
  Top 0.254: U8.127 56.86,3.38 57.93,2.31 75.46,2.31 76.98,3.83 76.98,6.62 77.74,7.39 80.79,7.39 82.06,8.66 82.06,10.18 D.G4
D5
  Top 0.254: U8.126 56.36,2.61 57.17,1.8 79.27,1.8 81.55,4.08 81.55,7.13 D.G5
D6
  Top 0.254: U8.124 55.36,2.34 56.41,1.29 79.78,1.29 82.06,3.58 82.06,5.1 D.G6
D7
  Top 0.254: U8.123 54.86,1.31 55.39,0.78 80.28,0.78 D.G7
FB_1V2
  Bottom 0.254: U5.10 35.38,33.74 36.34,32.79 R17.2
  Bottom 0.305: R16.1 34.78,30.72 35.58,31.52 35.58,31.77 35.83,32.02 36.25,32.02 R17.2
FB_3V3  (via drill 0.38)
  Top 0.254: v30.75,28.47 36.85,28.47 v37.61,27.71
  Bottom 0.254: U5.1 30.99,28.71 v30.75,28.47 | v37.61,27.71 36.89,27.71 R15.2
  Bottom 0.305: R14.1 35.03,28.25 35.83,27.45 35.83,27.2 36.3,27.2 R15.2
FLASH_CS  (via drill 0.38)
  Top 0.254: U8.38 64.86,29.83 64.74,29.71 63.98,29.71 63.47,29.2 63.47,24.37 v62.96,23.87
  Bottom 0.254: v62.96,23.87 62.96,22.85 59.15,19.04 59.15,17.69 U7.1
FLASH_SCK  (via drill 0.38)
  Top 0.254: U8.70 48.86,29.79 49.04,29.61 50.19,29.61 v50.69,29 | v53.87,27.96 v55.14,26.69
  Bottom 0.254: 56.41,24.37 U7.6 56.48,25.37 55.16,26.69 v55.14,26.69 | v50.69,29 52.83,29 v53.87,27.96
FLASH_SI  (via drill 0.38)
  Top 0.254: U8.64 51.86,27.55 v54.12,25.29
  Bottom 0.254: v54.12,25.29 54.12,24.66 54.5,24.28 55.19,24.28 U7.5
FLASH_SO  (via drill 0.38)
  Top 0.254: U8.65 51.36,27.04 52.73,25.67 52.73,16.78 v53.74,15.77
  Bottom 0.254: v53.74,15.77 57.3,15.77 57.8,16.28 57.8,17.52 U7.2
GND  (via drill 0.38)
  Top 0.254: U8.60 53.86,29.92 v54.07,29.71 | U8.49 59.36,29.75 v59.4,29.71 | U8.130 58.36,8.09 v58.13,7.61 | U8.136 61.36,8.09 v61.16,7.63 | U8.3 66.13,12.56 v65.75,12.18 | U8.13 65.8,17.56 v65.37,17.52 | U8.25 66.31,23.56 v66.26,23.61 | v51.3,15.38 51.3,15.59 | 51.28,25.39 v51.02,25.39 49.35,27.06 U8.77 | U8.113 49.86,11 v50.19,11.32 | ICU.4 17.16,27.33 v16.53,27.96 | U8.108 44.33,11.56 v43.2,10.43 | U8.96 46.77,17.56 47.01,17.8 48.79,17.8 49.17,18.18 49.17,19.45 48.66,19.96 47.77,19.96 v47.39,19.58 46.91,20.06 U8.91 | U8.73 45.51,29.84 v45.49,29.86 | U8.68 49.86,34 v49.55,34.31 | U8.54 56.86,32.73 v57.17,33.04 | PWR.C 64.82,49.52 v65.17,49.42 | SW1.2 SW1.4 81.05,52.09 B.GND@G
  Top 0.61: ICM.4 70.2,9.76 v69.82,10.15
  Bottom 0.254: v54.07,29.71 54.32,29.71 | v59.4,29.71 59.66,29.71 | v58.13,7.61 57.88,7.86 | v65.75,12.18 65.75,11.67 | v65.37,17.52 65.12,17.52 | v66.26,23.61 66.01,23.61 | C17.2 51.06,15.14 v51.3,15.38 | C16.2 51.06,25.43 v51.02,25.39 | v50.19,11.32 50.57,11.32 | v16.53,27.96 16.53,28.34 | v43.2,10.43 42.95,10.43 | v45.49,29.86 45.1,29.86 | v49.55,34.31 49.78,34.31 49.8,34.34 | v57.17,33.04 57.17,33.29
  Bottom 0.305: U5.6 28.99,32.55 v28.47,32.02 | C48.1 C50.1 33.15,30.39 34.06,29.48 36.34,29.48 | 36.34,29.48 R17.1 | U5.5 28.48,29.54 v28.44,29.51 | R15.1 36.34,29.48
  pour Bottom: -1.25,8.4 -1.25,47.01 6.37,47.01 6.37,55.14 85.95,55.14 85.95,44.47 94.92,44.47 94.92,8.91 85.95,8.91 85.95,-1.76 7.64,-1.76 7.64,8.4
  pour Route2: -2.52,55.9 95.27,55.9 95.27,-2.52 -2.52,-2.52
I2C-SCL  (via drill 0.38)
  Top 0.254: U8.84 47.69,23.56 v47.77,23.64 | v54.12,33.93 54.12,39.64 v59.2,44.72 | D.I2C-SCL@B5 88.92,8.91 90.19,10.18 90.19,35.58 v91.46,36.85
  Bottom 0.254: C.I2C-SCL@B5 4.85,16.53 3.32,18.05 3.32,41.68 6.12,44.47 A.I2C-SCL@B5 8.91,45.74 21.61,45.74 22.88,47.01 61.49,47.01 | v47.77,23.64 50.69,23.64 55.27,28.21 55.27,32.79 v54.12,33.93 | v59.2,44.72 61.49,47.01 | 65.04,47.65 79.39,47.65 81.3,45.74 90.19,45.74 91.46,44.47 v91.46,36.85 B.I2C-SCL@B5 | 65.04,47.65 62.12,47.65 61.49,47.01 | R7.1 65.17,47.52 65.04,47.65
I2C-SDA  (via drill 0.38)
  Top 0.254: U8.85 44.04,23.06 v43.84,23.26 | v44.6,34.82 44.6,38.76 v44.98,39.14 | D.I2C-SDA@B4 88.28,11.45 89.56,12.72 89.56,38.76 v90.19,39.39
  Bottom 0.254: 67.33,40.66 46.63,40.66 45.1,39.14 v44.98,39.14 44.72,39.39 15.26,39.39 v11.45,43.2 8.91,43.2 A.I2C-SDA@B4 5.61,41.93 4.08,40.41 4.08,18.82 5.1,17.8 8.53,17.8 8.91,17.42 8.91,15.26 C.I2C-SDA@B4 | 67.33,40.66 84.6,40.66 B.I2C-SDA@B4 v90.19,39.39 | v43.84,23.26 43.84,28.59 41.93,30.5 41.93,32.15 v44.6,34.82 | R4.1 67.2,40.79 67.33,40.66
ICM1  (via drill 0.38)
  Top 0.254: U8.137 61.86,11.08 v61.94,11.17 | ICM.1 78.9,8.56 v78.45,8.12
  Bottom 0.254: v61.94,11.17 61.94,5.83 62.71,5.07 76.17,5.07 78.45,7.36 v78.45,8.12
ICM3  (via drill 0.38)
  Top 0.254: U8.138 62.36,8.21 v62.71,7.86 | ICM.3 78.43,9.36 v78.2,9.13
  Bottom 0.254: v62.71,7.86 62.71,6.34 63.47,5.58 75.91,5.58 77.69,7.36 77.69,8.63 v78.2,9.13
ICM5  (via drill 0.38)
  Top 0.254: U8.139 62.86,11.07 v62.96,11.17 | ICM.5 77.71,10.16 v77.44,9.9
  Bottom 0.254: v62.96,11.17 63.21,11.17 63.47,10.91 63.47,6.59 63.98,6.09 73.63,6.09 74.39,6.85 74.39,8.12 76.17,9.9 v77.44,9.9
ICM7  (via drill 0.38)
  Top 0.254: U8.140 63.36,8.23 63.72,7.86 v64.48,7.86 | ICM.7 76.98,10.96 v76.68,10.66
  Bottom 0.254: v64.48,7.86 64.48,6.85 64.74,6.59 72.87,6.59 73.88,7.61 73.88,8.63 75.91,10.66 v76.68,10.66
ICM9  (via drill 0.38)
  Top 0.254: U8.141 63.86,11.54 v63.47,11.93 | ICM.9 76.26,11.76 v75.91,11.42
  Bottom 0.254: v75.91,11.42 71.6,7.1 65.75,7.1 65.25,7.61 65.25,8.37 64.23,9.39 64.23,11.17 v63.47,11.93
ICM11  (via drill 0.38)
  Top 0.254: U8.142 64.36,11.3 v64.74,11.67 | ICM.11 78.33,12.56 v78.2,12.44
  Bottom 0.254: v64.74,11.67 64.74,9.64 65.75,8.63 65.75,8.12 66.26,7.61 70.83,7.61 75.66,12.44 v78.2,12.44
ICM13
  Top 0.254: U8.143 64.86,10.53 64.99,10.66 67.02,10.66 69.82,7.86 73.63,7.86 75.15,9.39 75.15,11.93 76.59,13.36 ICM.13
ICM15
  Top 0.254: U8.1 69.96,11.56 70.33,11.93 70.33,14.98 70.58,15.23 76.42,15.23 77.49,14.16 ICM.15
ICM17
  Top 0.254: U8.2 69.44,12.06 69.82,12.44 69.82,15.23 70.33,15.74 79.22,15.74 79.72,16.25 79.72,17.87 ICM.17
ICM19  (via drill 0.38)
  Top 0.254: U8.5 68.95,13.56 v69.06,13.45 | v78.45,18.79 79.84,18.79 ICM.19
  Bottom 0.254: v69.06,13.45 73.12,13.45 v78.45,18.79
ICM21  (via drill 0.38)
  Top 0.254: U8.6 65.91,14.06 v65.75,14.21 | v78.2,19.8 79.98,19.8 ICM.21
  Bottom 0.254: v65.75,14.21 72.61,14.21 v78.2,19.8
ICM23  (via drill 0.38)
  Top 0.254: v77.69,20.56 ICM.23 | U8.7 68.79,14.56 v69.11,14.87
  Bottom 0.254: v77.69,20.56 72.1,14.98 69.21,14.98 v69.11,14.87
ICM25  (via drill 0.38)
  Top 0.254: U8.8 65.92,15.06 v65.75,15.23 | v76.68,21.33 79.98,21.33 ICM.25
  Bottom 0.254: v65.75,15.23 66.26,15.74 71.09,15.74 v76.68,21.33
ICM27
  Top 0.254: ICM.27 79.84,22.34 76.42,22.34 75.66,21.58 75.66,17.26 74.64,16.25 69.82,16.25 69.13,15.56 U8.9
ICM28
  Top 0.254: U8.23 ICM.28
ICM29
  Top 0.254: U8.10 68.87,16.06 69.56,16.75 74.39,16.75 75.15,17.52 75.15,22.09 76.17,23.1 79.87,23.1 ICM.29
ICM30
  Top 0.254: U8.24 69.77,23.06 70.07,23.36 ICM.30
ICM31
  Top 0.254: U8.11 68.61,16.56 69.31,17.26 74.14,17.26 74.39,17.52 74.39,22.09 76.17,23.87 79.91,23.87 ICM.31
ICM32
  Top 0.254: U8.26 71.71,24.06 ICM.32
ICM33  (via drill 0.38)
  Top 0.254: U8.12 66.31,17.06 v65.75,16.5 | v78.2,24.63 79.95,24.63 ICM.33
  Bottom 0.254: v65.75,16.5 70.07,16.5 v78.2,24.63
ICM34
  Top 0.254: U8.27 68.99,24.56 69.31,24.88 71.73,24.88 ICM.34
ICM35
  Top 0.254: U8.14 69.02,18.06 69.31,17.77 73.37,17.77 73.88,18.28 73.88,23.1 76.17,25.39 79.99,25.39 ICM.35
ICM36
  Top 0.254: U8.29 70.24,25.56 70.33,25.64 71.69,25.64 ICM.36
ICM37  (via drill 0.38)
  Top 0.254: v78.2,26.15 ICM.37 | U8.15 69.94,18.56 v70.07,18.43
  Bottom 0.254: v78.2,26.15 70.48,18.43 v70.07,18.43
ICM38
  Top 0.254: U8.30 69.22,26.06 69.56,26.41 71.66,26.41 ICM.38
ICM39  (via drill 0.38)
  Top 0.254: v77.69,26.91 79.96,26.91 ICM.39 | U8.16 69.61,19.06 v70.05,19.5
  Bottom 0.254: v70.05,19.5 70.28,19.5 v77.69,26.91
ICM40
  Top 0.254: U8.32 70.22,27.06 70.58,27.42 71.76,27.42 ICM.40
ICM41  (via drill 0.38)
  Top 0.254: v77.18,27.68 79.93,27.68 ICM.41 | U8.17 68.81,19.56 v69.31,20.06
  Bottom 0.254: v77.18,27.68 69.56,20.06 v69.31,20.06
ICM42
  Top 0.254: U8.33 69.7,27.56 70.33,28.18 71.79,28.18 ICM.42
ICM43  (via drill 0.38)
  Top 0.254: U8.21 68.82,21.56 v69.31,21.07 | v76.68,28.44 79.89,28.44 ICM.43
  Bottom 0.254: v69.31,21.07 v76.68,28.44
ICM44
  Top 0.254: U8.34 69.44,28.06 70.33,28.95 71.8,28.95 ICM.44
ICM45  (via drill 0.38)
  Top 0.254: U8.22 66.04,22.06 v65.75,22.34 | v75.66,29.45 79.92,29.45 ICM.45
  Bottom 0.254: v65.75,22.34 68.55,22.34 v75.66,29.45
ICM46
  Top 0.254: U8.35 69.18,28.56 70.33,29.71 71.76,29.71 ICM.46
ICM47  (via drill 0.38)
  Top 0.254: v76.68,30.22 79.96,30.22 ICM.47 | U8.44 61.86,32.84 v61.84,33.11
  Bottom 0.254: v76.68,30.22 72.87,34.03 62.45,34.03 61.94,33.52 61.94,32.96 v61.84,33.11
ICM48
  Top 0.254: U8.40 63.86,33 64.16,33.29 67.25,33.29 70.07,30.47 71.72,30.47 ICM.48
ICM49
  Top 0.254: ICM.49 75.76,30.96 72.41,34.31 61.87,34.31 61.11,33.55 61.11,32.79 61.36,32.53 U8.45
ICM50
  Top 0.254: U8.41 63.36,33.39 63.77,33.8 68.01,33.8 70.33,31.49 71.69,31.49 ICM.50
ICM51  (via drill 0.38)
  Top 0.254: U8.46 60.86,28.62 v60.67,28.44 | v78.45,31.74 79.99,31.74 ICM.51
  Bottom 0.254: v78.45,31.74 78.2,31.99 78.2,34.03 77.18,35.04 61.18,35.04 60.67,34.53 60.67,29.89 60.86,29.71 60.86,28.62 v60.67,28.44
ICM52  (via drill 0.38)
  Top 0.254: v70.33,32.5 70.58,32.25 71.73,32.25 ICM.52 | U8.43 62.36,32.44 v62.71,32.78
  Bottom 0.254: v70.33,32.5 70.07,32.76 62.73,32.76 v62.71,32.78
ICOG-UTIL-1
  Top 0.254: U8.87 43.51,22.06 42.18,23.39 20.34,23.39 16.02,19.07 16.02,17.57 ICU.1
ICOG-UTIL-3
  Top 0.254: U8.88 43.25,21.56 41.93,22.88 20.85,22.88 16.78,18.82 16.78,17.53 ICU.3
ICOG-UTIL-5
  Top 0.254: ICU.5 17.56,18.83 19.58,20.85 37.61,20.85 38.12,20.34 43.45,20.34 44.23,19.56 U8.92
ICOG-UTIL-7
  Top 0.254: ICU.7 18.36,12.16 19.32,11.2 39.39,11.2 41.25,13.06 U8.105
ICOG-UTIL-9
  Top 0.254: ICU.9 19.16,12.38 19.83,11.7 39.14,11.7 40.99,13.56 U8.104
ICOG-UTIL-11
  Top 0.254: ICU.11 19.96,12.85 20.59,12.21 38.88,12.21 41.23,14.56 U8.102
ICOG-UTIL-13
  Top 0.254: ICU.13 20.76,13.82 21.86,12.72 38.63,12.72 40.53,14.62 40.66,14.75 40.97,15.06 U8.101
ICOG-UTIL-15
  Top 0.254: ICU.15 21.56,14.04 22.37,13.23 38.37,13.23 40.71,15.56 U8.100
ICOG-UTIL-17
  Top 0.254: ICU.17 25.56,14.61 26.44,13.74 38.12,13.74 40.44,16.06 U8.99
ICOG-UTIL-19  (via drill 0.38)
  Top 0.254: U8.98 44.44,16.56 v44.19,16.78 | v26.44,15.01 26.44,17.43 ICU.19
  Bottom 0.254: v44.19,16.78 28.21,16.78 v26.44,15.01
ICOG-UTIL-21  (via drill 0.38)
  Top 0.254: U8.97 47.24,17.06 v47.26,16.91 | v27.45,14.75 27.45,15.01 27.16,15.3 ICU.21
  Bottom 0.254: v47.26,16.91 47.26,16.4 46.76,16.02 28.72,16.02 v27.45,14.75
ICOG-UTIL-23  (via drill 0.38)
  Top 0.254: U8.95 v44.22,18.06 v44.22,18.05 | v27.96,19.32 ICU.23
  Bottom 0.254: v44.22,18.05 29.23,18.05 v27.96,19.32
ICOG-UTIL-25  (via drill 0.38)
  Top 0.254: U8.93 44.33,19.06 v44.19,18.92 | 29.13,19.48 v29.33,19.48 28.76,18.91 ICU.25
  Bottom 0.254: v44.19,18.92 29.89,18.92 v29.33,19.48
JTAG-TCK  (via drill 0.38)
  Top 0.254: U8.109 47.86,6.97 46.76,5.86 25.91,5.86 JTAG.4 | ICU.14 21.16,27.51 v21.23,27.58
  Bottom 0.254: v21.23,27.58 21.23,10.54 JTAG.4
JTAG-TDI  (via drill 0.38)
  Top 0.254: U8.110 48.36,6.7 47.01,5.35 21.34,5.35 JTAG.2 | ICU.10 19.56,24.26 v18.69,23.39
  Bottom 0.254: v18.69,23.39 18.69,18.69 18.94,18.44 JTAG.2
JTAG-TDO  (via drill 0.38)
  Top 0.254: U8.106 41.52,12.56 39.64,10.69 24.42,10.69 JTAG.3 | ICU.12 20.36,27.18 v19.83,27.71
  Bottom 0.254: v19.83,27.71 19.83,25.93 20.34,25.42 20.34,8.89 JTAG.3
JTAG-TMS  (via drill 0.38)
  Top 0.254: U8.107 41.78,12.06 39.9,10.18 35.45,10.18 v32.15,6.88 | ICU.8 18.76,27.13 v18.31,27.58
  Bottom 0.254: v18.31,27.58 18.31,27.2 16.53,25.42 16.53,7.88 JTAG.1 18.54,5.61 30.88,5.61 v32.15,6.88
N$1
  Top 0.254: PWR.A 62.3,51.62 R1.1
N$2
  Bottom 0.254: R2.1 63.45,51.8 CHG.C
N$3  (via drill 0.38)
  Top 0.406: v41.93,45.74 41.93,48.28 v43.2,49.55
  Bottom 0.406: U1.1 40.98,44.78 v41.93,45.74 | v43.2,49.55 58.44,49.55 59.71,50.82 60.89,50.82 R2.2
N$4
  Bottom 0.406: R3.1 29.3,44.76 U1.5
OSC_IN  (via drill 0.38)
  Top 0.254: U8.94 v48.28,18.56
  Bottom 0.254: v48.28,18.56 48.28,16.4 47.01,15.13 45.1,15.13 42.31,12.34 40.67,12.34 OSC.3@3
PWRIN  (via drill 0.38)
  Top 0.61: ICU.6 17.96,24.18 v17.55,23.77
  Top 0.813: FTDI.4 51.83,46.75 v53.36,48.28
  Route3 0.813: v53.36,48.28 69.87,48.28 71.14,49.55 71.14,50.36 PSW1.2 | v17.55,23.77 15.64,23.77 13.99,25.42 13.99,33.17 v23.52,42.69 23.52,42.56 26.94,42.56 27.58,41.93 33.17,41.93 33.55,42.31 35.33,42.31 v36.6,41.04
  Bottom 0.61: v17.55,23.77 17.55,23.52
  Bottom 0.813: D1.C 25.29,40.91 v23.52,42.69 | v36.6,41.04 43.58,41.04 44.47,41.93 50.82,41.93 51.84,42.95 FTDI.4
RESET/DTR  (via drill 0.38)
  Top 0.254: 7.39,18.82 C.RESET@B6 | U8.37 65.4,31.41 66.06,30.75 68.47,30.75 v69.11,30.12 | SW1.3 SW1.1 77.01,49.84 v76.47,49.3 | D.RESET@B6 86.38,6.37 87.65,7.64 88.92,7.64 90.83,9.54 90.83,33.67 v91.46,34.31
  Route3 0.254: v2.31,26.18 2.31,21.86 5.1,19.07 C.RESET@B6 | A.RESET@B6 8.91,48.28 40.28,48.28 FTDI.1 46.87,47.01 59.71,47.01 64.79,41.93 | B.RESET@B6 84.6,35.58 72.03,35.58 69.11,32.66 v69.11,30.12 66.44,30.12 64.79,31.77 64.79,41.93 | v76.47,49.3 75.97,49.3 68.6,41.93 64.79,41.93
  Bottom 0.254: A.RESET@B6 6.88,47.01 2.31,42.44 v2.31,26.18 | v69.11,30.12 69.11,31.52 68.73,31.9 R33.1 | v91.46,34.31 B.RESET@B6
RX  (via drill 0.38)
  Top 0.254: U8.112 v49.36,12.72 49.36,16.21 v49.3,16.28 | ICU.27 29.56,15.18 v30.12,14.62
  Route3 0.254: FTDI.3 50.31,43.33 50.31,30.63 49.3,29.61 v49.3,16.28 | v30.12,14.62 30.12,13.61 31.01,12.72 v49.36,12.72
SPI-CSA  (via drill 0.38)
  Top 0.254: U8.79 46.88,26.06 v47.39,25.55
  Route3 0.254: v47.39,25.55 45.61,25.55 39.39,31.77 39.39,41.93 36.85,44.47 22.88,44.47 19.07,40.66 8.91,40.66 A.SPI-CS@B3
SPI-CSB  (via drill 0.38)
  Top 0.254: U8.39 64.36,32.61 64.54,32.79 65.42,32.79 v66.31,31.9
  Route3 0.254: v66.31,31.9 66.31,33.29 73.68,40.66 84.6,40.66 B.SPI-CS@B3
  Bottom 0.254: v66.31,31.9 66.31,31.35 R6.1
SPI-CSC  (via drill 0.38)
  Top 0.254: U8.111 48.86,11.12 v48.41,11.58 | ICU.31 31.16,15.36 v31.39,15.13
  Route3 0.254: C.SPI-CS@B3 8.91,12.72 11.45,12.72 12.59,11.58 v48.41,11.58 49.3,11.58 50.69,12.97 50.82,12.97 48.66,15.13 v31.39,15.13
SPI-CSD  (via drill 0.38)
  Top 0.254: U8.144 66.39,9.21 v66.44,9.16
  Route3 0.254: v66.44,9.16 72.66,9.16 73.68,10.18 73.68,12.72 76.22,15.26 84.6,15.26 D.SPI-CS@B3
SPI-MISO  (via drill 0.38)
  Top 0.254: A.SPI-MISO@B0 6.37,31.77 5.1,30.5 5.1,6.37 C.SPI-MISO@B0 | U8.59 54.36,32.55 v54.12,32.91 | v87.02,5.61 88.41,5.61 89.17,6.37 90.95,6.37 92.73,8.15 v92.73,20.34 92.73,28.59 v92.73,30.5 92.73,43.71 88.41,48.03 87.4,48.03 B.SPI-MISO@B0
  Bottom 0.254: C.SPI-MISO@B0 8.91,5.1 12.72,5.1 16.53,1.29 80.67,1.29 81.94,2.56 83.71,2.56 84.6,3.45 84.6,4.72 84.98,5.1 86.51,5.1 v87.02,5.61 | B.SPI-MISO@B0 87.02,49.55 | v54.12,32.91 53.74,32.91 53.11,33.55 53.11,34.44 53.49,34.82 59.58,34.82 60.47,35.71 78.63,35.71 81.3,33.04 90.19,33.04 v92.73,30.5 | D.SPI-MISO@B0 91.46,21.61 v92.73,20.34
SPI-MOSI  (via drill 0.38)
  Top 0.254: U8.74 48.5,28.56 v48.66,28.72 | D.SPI-MOSI@B1 87.65,19.07 88.28,19.7 v88.28,34.95 88.28,35.58 88.28,45.74 v87.65,46.38
  Bottom 0.254: A.SPI-MOSI@B1 8.91,35.58 15.26,35.58 | 15.26,35.58 49.55,35.58 | 49.55,35.58 57.17,35.58 58.19,36.6 81.17,36.6 82.19,35.58 87.65,35.58 v88.28,34.95 | C.SPI-MOSI@B1 8.91,7.64 12.72,7.64 12.72,7.77 13.74,8.78 13.74,34.06 15.26,35.58 | v48.66,28.72 48.66,34.69 49.55,35.58 | v87.65,46.38 86.51,46.38 B.SPI-MOSI@B1
SPI-SCK  (via drill 0.38)
  Top 0.254: U8.75 49.78,28.06 v50.06,28.34 | v51.84,32.91 v51.84,36.47 | D.SPI-SCK@B2 87.65,16.53 88.92,17.8 88.92,35.58 v88.92,37.48 88.92,43.84 v89.56,44.47
  Bottom 0.254: 53.36,38.12 8.91,38.12 A.SPI-SCK@B2 6.37,36.85 5.1,35.58 5.1,27.96 6.37,26.69 11.45,26.69 12.72,25.42 12.72,11.45 11.45,10.18 8.91,10.18 C.SPI-SCK@B2 | 53.36,38.12 88.28,38.12 v88.92,37.48 | v50.06,28.34 50.06,31.13 v51.84,32.91 | v51.84,36.47 51.84,36.6 53.36,38.12 | v89.56,44.47 B.SPI-SCK@B2
SW_1V2
  Bottom 0.254: U5.8 29.99,34.56 29.74,34.82 24.66,34.82 24.15,34.31 24.15,33 L2.1
SW_3V3
  Bottom 0.305: U5.4 29.49,28.73 29.23,28.47 24.4,28.47 24.15,28.21 24.15,26.52 L1.1
TX  (via drill 0.38)
  Top 0.254: ICU.29 30.36,19.44 v30.88,19.96 | U8.78 47.77,26.56 v47.9,26.44
  Route3 0.254: FTDI.2 42.69,40.29 42.69,31.26 47.52,26.44 v47.9,26.44 48.15,26.18 48.15,25.17 42.95,19.96 v30.88,19.96
VBAT  (via drill 0.38)
  Top 0.813: v34.31,41.04 34.27,41.09 22.71,41.09 19.96,43.84 16.56,43.84 JP1.2
  Bottom 0.406: C2.1 34.18,42.88 U1.3 32.48,42.34 D1.A
  Bottom 0.813: v34.31,41.04 34.31,42.76 C2.1

### Text on the board
Dimension: <---Cutout
tPlace: Ae7 | MISO | RST | Ae6 | Be1 | MOSI | SCL | Ae5 | Be2 | SCK | Dtr | Tx | Rx | 5V | Gnd | Gnd | SDA | Ae4 | - + | Be3 | CSB | CSA | Ae3 | Papilio Platform | Be4 | SDA | A | B | Papilio Flex | Be5 | SCK | Ae2 | www.GadgetFactory.net | SCL | Ver 1.0 | MOSI | Ae1 | RST | MISO | Ae0 | 5V | GND | GND | 3.3V | Utility iCog | 3.3V | GND | Memory iCog | 5V | MISO | MOSI | RST | 12/7/2016 | SCL | SCK | SDA | Ce4 | CSD | CSC | Ce3 | SDA | C | Ce2 | SCK | SCL | MOSI | Ce1 | Copyright 2016 | RST | MISO | Gadget Factory, LLC | Ce0 | De7 | Get Started at Flex.GadgetFactory.net | D | GND
bPlace: Dtr | Tx | Rx | 5V | Gnd | Gnd | - +
tNames: Reset
Reference: TOP Silkscreen is on layer 200